# EAGLE design ScoreBoard-V2 (EAGLE 9.4.2)

## Sheet 1 of 2
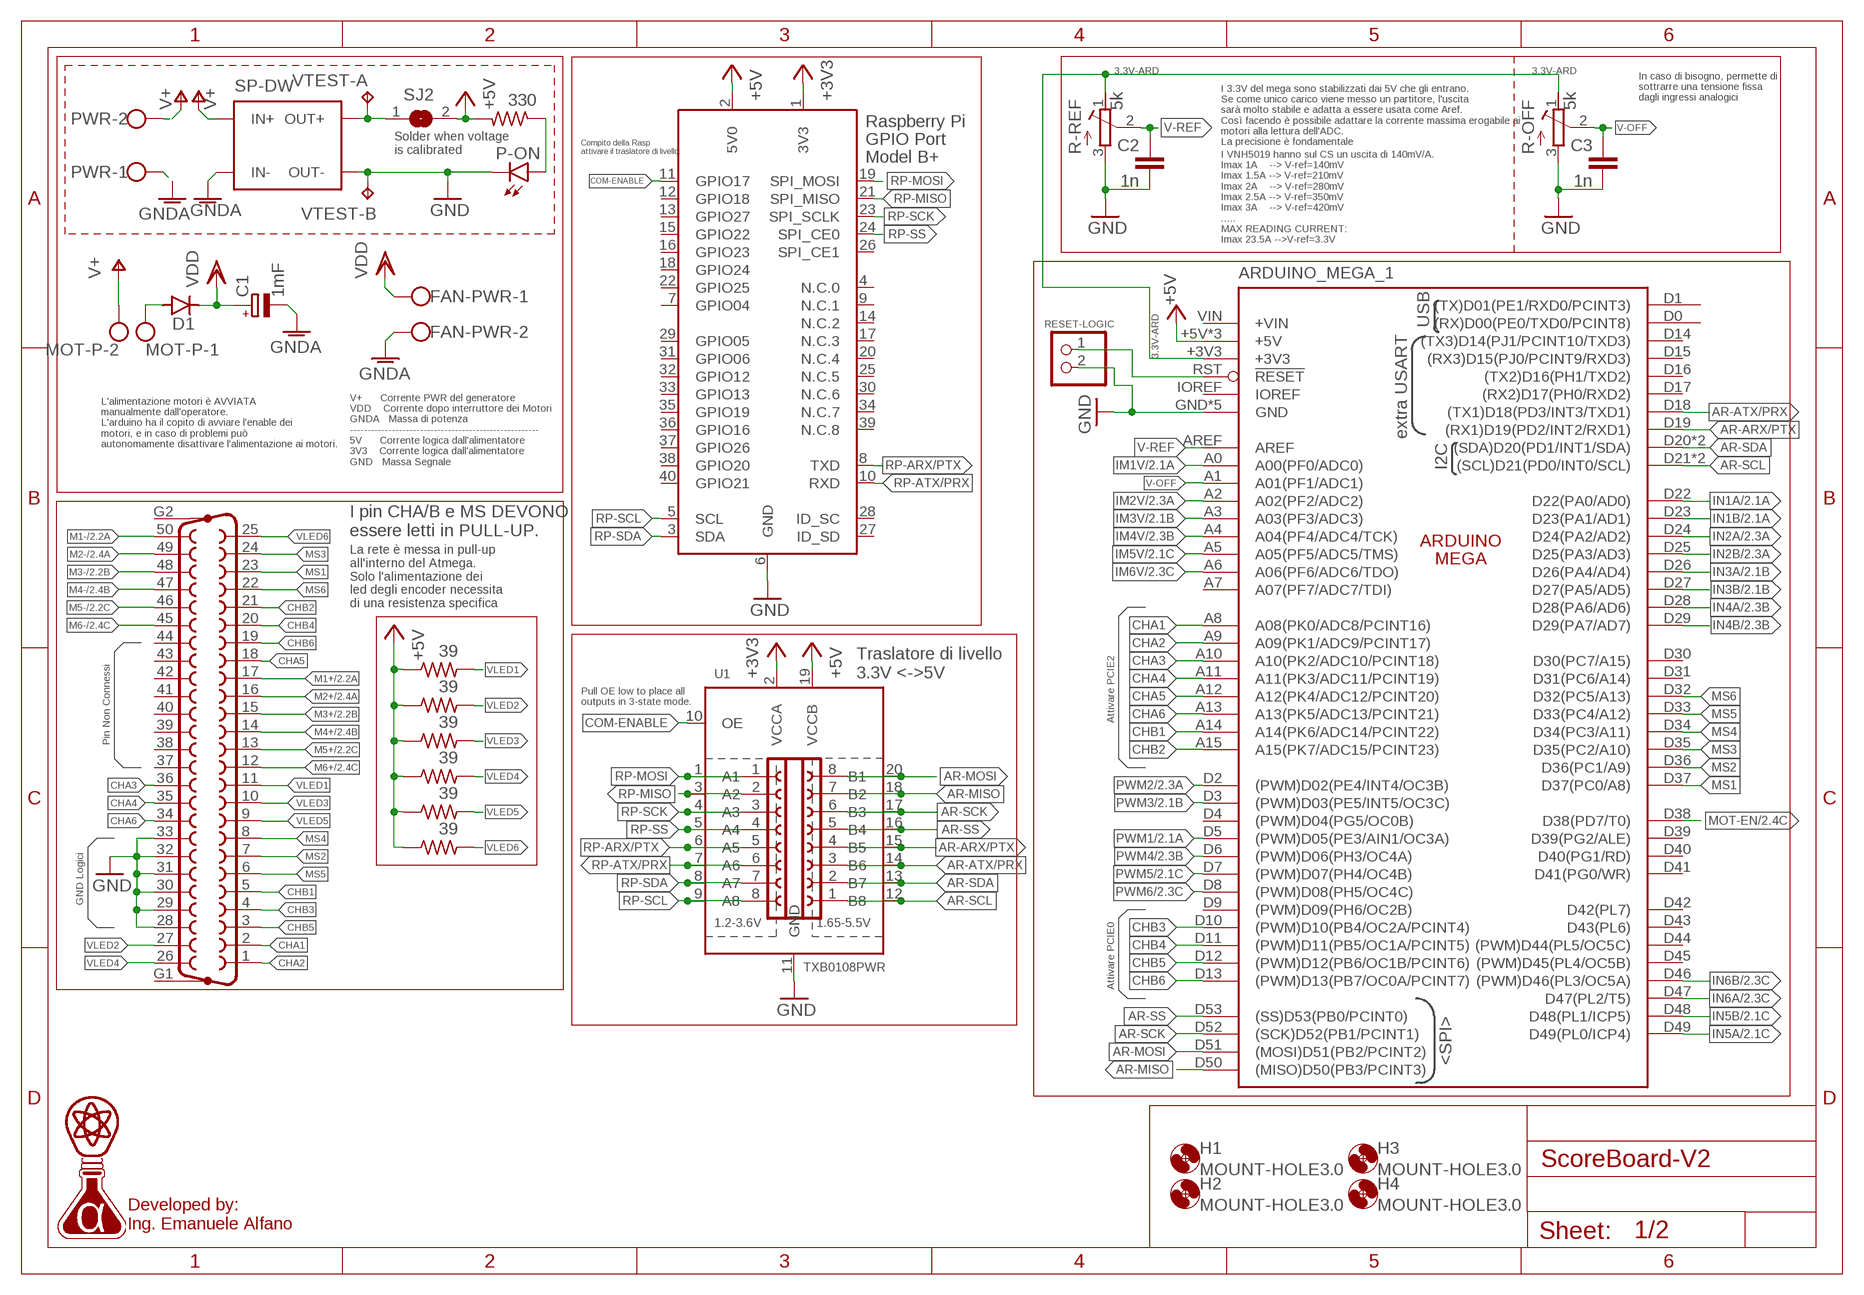
[diagram p0: schematic, sheet 1]

### Parts
ARDUINO_MEGA_1  MEGA_ARDUINONO-HOLE  [MEGA-NO-HOLE]
C1  1mF  CPOL-EUE5-13  [E5-13]
C2  1n  C-EU025-024X044  [C025-024X044]
C3  1n  C-EU025-024X044  [C025-024X044]
D1  ES2D  [SMB]
D-SUB50  F50VP  [F50VP]
FAN-PWR  W237-102  [W237-102]
H1  MOUNT-HOLE3.0  [3,0]
H2  MOUNT-HOLE3.0  [3,0]
H3  MOUNT-HOLE3.0  [3,0]
H4  MOUNT-HOLE3.0  [3,0]
MOT-P  W237-102  [W237-102]
P-ON  LED3MM  [LED3MM]
PWR  W237-102  [W237-102]
R1  39  R-US_0204/5  [0204/5]
R2  39  R-US_0204/5  [0204/5]
R3  39  R-US_0204/5  [0204/5]
R4  39  R-US_0204/5  [0204/5]
R5  39  R-US_0204/5  [0204/5]
R6  39  R-US_0204/5  [0204/5]
R-OFF  5k  R-TRIMMT93YA  [RTRIMT93YA]
R-REF  5k  R-TRIMMT93YA  [RTRIMT93YA]
RASPBERRY-PY  RASPI_GPIO_B+_BOX  [RASPI_GPIO_B+_BOX]
RESET-LOGIC  PINHD-1X2  [1X02]
RL  330  R-US_0204/7  [0204/7]
SJ2  SJ  [SJ]
SP-DW  DC/DC-STEP-DOWNGLOB  [DC/DC-STEP-DOWN-UNIVERSAL]
SV1  FE08-1  [FE08]
SV2  FE08-1  [FE08]
U1  TXB0108PWR  [TSSOP20]
VTEST-  TP2P2-38-17  [P2-38-17]

### Nets
3.3V-ARD [PLogic]: ARDUINO_MEGA_1.+3V3 R-OFF.1(E) R-REF.1(E)
+3V3: RASPBERRY-PY.1(3V3) U1.2(VCCA)
+5V [PLogic]: ARDUINO_MEGA_1.+5V ARDUINO_MEGA_1.+5V1(+5V) ARDUINO_MEGA_1.+5V2(+5V) R1.1 R2.1 R3.1 R4.1 R5.1 R6.1 RASPBERRY-PY.2(5V0) RL.2 SJ2.2 U1.19(VCCB) ; also sheet 2
AR-ARX/PTX [Logic]: ARDUINO_MEGA_1.D19((RX1)D19(PD2/INT2/RXD1)) SV2.4 U1.15(B5)
AR-ATX/PRX [Logic]: ARDUINO_MEGA_1.D18((TX1)D18(PD3/INT3/TXD1)) SV2.3 U1.14(B6)
AR-MISO [Logic]: ARDUINO_MEGA_1.D50((MISO)D50(PB3/PCINT3)) SV2.7 U1.18(B2)
AR-MOSI [Logic]: ARDUINO_MEGA_1.D51((MOSI)D51(PB2/PCINT2)) SV2.8 U1.20(B1)
AR-SCK [Logic]: ARDUINO_MEGA_1.D52((SCK)D52(PB1/PCINT1)) SV2.6 U1.17(B3)
AR-SCL [Logic]: ARDUINO_MEGA_1.D21((SCL)D21(PD0/INT0/SCL)) ARDUINO_MEGA_1.SCL1((SCL)D21(PD0/INT0/SCL)) SV2.1 U1.12(B8)
AR-SDA [Logic]: ARDUINO_MEGA_1.D20((SDA)D20(PD1/INT1/SDA)) ARDUINO_MEGA_1.SDA1((SDA)D20(PD1/INT1/SDA)) SV2.2 U1.13(B7)
AR-SS [Logic]: ARDUINO_MEGA_1.D53((SS)D53(PB0/PCINT0)) SV2.5 U1.16(B4)
CHA1 [Logic]: ARDUINO_MEGA_1.A8(A08(PK0/ADC8/PCINT16)) D-SUB50.2
CHA2 [Logic]: ARDUINO_MEGA_1.A9(A09(PK1/ADC9/PCINT17)) D-SUB50.1
CHA3 [Logic]: ARDUINO_MEGA_1.A10(A10(PK2/ADC10/PCINT18)) D-SUB50.36
CHA4 [Logic]: ARDUINO_MEGA_1.A11(A11(PK3/ADC11/PCINT19)) D-SUB50.35
CHA5 [Logic]: ARDUINO_MEGA_1.A12(A12(PK4/ADC12/PCINT20)) D-SUB50.18
CHA6 [Logic]: ARDUINO_MEGA_1.A13(A13(PK5/ADC13/PCINT21)) D-SUB50.34
CHB1 [Logic]: ARDUINO_MEGA_1.A14(A14(PK6/ADC14/PCINT22)) D-SUB50.5
CHB2 [Logic]: ARDUINO_MEGA_1.A15(A15(PK7/ADC15/PCINT23)) D-SUB50.21
CHB3 [Logic]: ARDUINO_MEGA_1.D10((PWM)D10(PB4/OC2A/PCINT4)) D-SUB50.4
CHB4 [Logic]: ARDUINO_MEGA_1.D11((PWM)D11(PB5/OC1A/PCINT5)) D-SUB50.20
CHB5 [Logic]: ARDUINO_MEGA_1.D12((PWM)D12(PB6/OC1B/PCINT6)) D-SUB50.3
CHB6 [Logic]: ARDUINO_MEGA_1.D13((PWM)D13(PB7/OC0A/PCINT7)) D-SUB50.19
COM-ENABLE: RASPBERRY-PY.11(GPIO17) U1.10(OE)
GND [PLogic]: ARDUINO_MEGA_1.GND ARDUINO_MEGA_1.GND1(GND) ARDUINO_MEGA_1.GND2(GND) ARDUINO_MEGA_1.GND3(GND) ARDUINO_MEGA_1.GND4(GND) C2.2 C3.2 D-SUB50.28 D-SUB50.29 D-SUB50.30 D-SUB50.31 D-SUB50.32 D-SUB50.33 P-ON.K(C) R-OFF.3(A) R-REF.3(A) RASPBERRY-PY.6(GND) RESET-LOGIC.2 SP-DW.OUT- SP-DW.OUT-1(OUT-) SP-DW.OUT-2(OUT-) U1.11(GND) VTEST-.TP-2 ; also sheet 2
GNDA [PowerJack]: C1.- FAN-PWR.2 PWR.1 SP-DW.IN- SP-DW.IN-1(IN-) SP-DW.IN-2(IN-) ; also sheet 2
IM1V [Logic]: ARDUINO_MEGA_1.A0(A00(PF0/ADC0)) ; also sheet 2
IM2V [Logic]: ARDUINO_MEGA_1.A2(A02(PF2/ADC2)) ; also sheet 2
IM3V [Logic]: ARDUINO_MEGA_1.A3(A03(PF3/ADC3)) ; also sheet 2
IM4V [Logic]: ARDUINO_MEGA_1.A4(A04(PF4/ADC4/TCK)) ; also sheet 2
IM5V [Logic]: ARDUINO_MEGA_1.A5(A05(PF5/ADC5/TMS)) ; also sheet 2
IM6V [Logic]: ARDUINO_MEGA_1.A6(A06(PF6/ADC6/TDO)) ; also sheet 2
IN1A [Logic]: ARDUINO_MEGA_1.D22(D22(PA0/AD0)) ; also sheet 2
IN1B [Logic]: ARDUINO_MEGA_1.D23(D23(PA1/AD1)) ; also sheet 2
IN2A [Logic]: ARDUINO_MEGA_1.D24(D24(PA2/AD2)) ; also sheet 2
IN2B [Logic]: ARDUINO_MEGA_1.D25(D25(PA3/AD3)) ; also sheet 2
IN3A [Logic]: ARDUINO_MEGA_1.D26(D26(PA4/AD4)) ; also sheet 2
IN3B [Logic]: ARDUINO_MEGA_1.D27(D27(PA5/AD5)) ; also sheet 2
IN4A [Logic]: ARDUINO_MEGA_1.D28(D28(PA6/AD6)) ; also sheet 2
IN4B [Logic]: ARDUINO_MEGA_1.D29(D29(PA7/AD7)) ; also sheet 2
IN5A [Logic]: ARDUINO_MEGA_1.D49(D49(PL0/ICP4)) ; also sheet 2
IN5B [Logic]: ARDUINO_MEGA_1.D48(D48(PL1/ICP5)) ; also sheet 2
IN6A [Logic]: ARDUINO_MEGA_1.D47(D47(PL2/T5)) ; also sheet 2
IN6B [Logic]: ARDUINO_MEGA_1.D46((PWM)D46(PL3/OC5A)) ; also sheet 2
M1+ [PMot]: D-SUB50.17 ; also sheet 2
M1- [PMot]: D-SUB50.50 ; also sheet 2
M2+ [PMot]: D-SUB50.16 ; also sheet 2
M2- [PMot]: D-SUB50.49 ; also sheet 2
M3+ [PMot]: D-SUB50.15 ; also sheet 2
M3- [PMot]: D-SUB50.48 ; also sheet 2
M4+ [PMot]: D-SUB50.14 ; also sheet 2
M4- [PMot]: D-SUB50.47 ; also sheet 2
M5+ [PMot]: D-SUB50.13 ; also sheet 2
M5- [PMot]: D-SUB50.46 ; also sheet 2
M6+ [PMot]: D-SUB50.12 ; also sheet 2
M6- [PMot]: D-SUB50.45 ; also sheet 2
MOT-EN [Logic]: ARDUINO_MEGA_1.D38(D38(PD7/T0)) ; also sheet 2
MS1 [Logic]: ARDUINO_MEGA_1.D37(D37(PC0/A8)) D-SUB50.23
MS2 [Logic]: ARDUINO_MEGA_1.D36(D36(PC1/A9)) D-SUB50.7
MS3 [Logic]: ARDUINO_MEGA_1.D35(D35(PC2/A10)) D-SUB50.24
MS4 [Logic]: ARDUINO_MEGA_1.D34(D34(PC3/A11)) D-SUB50.8
MS5 [Logic]: ARDUINO_MEGA_1.D33(D33(PC4/A12)) D-SUB50.6
MS6 [Logic]: ARDUINO_MEGA_1.D32(D32(PC5/A13)) D-SUB50.22
N$1: P-ON.A RL.1
N$2 [PowerJack]: D1.A MOT-P.1
N$4 [PLogic]: SJ2.1 SP-DW.OUT+ SP-DW.OUT+1(OUT+) SP-DW.OUT+2(OUT+) VTEST-.TP-1
N$5: ARDUINO_MEGA_1.RST(!RESET) RESET-LOGIC.1
PWM1 [Logic]: ARDUINO_MEGA_1.D5((PWM)D05(PE3/AIN1/OC3A)) ; also sheet 2
PWM2 [Logic]: ARDUINO_MEGA_1.D2((PWM)D02(PE4/INT4/OC3B)) ; also sheet 2
PWM3 [Logic]: ARDUINO_MEGA_1.D3((PWM)D03(PE5/INT5/OC3C)) ; also sheet 2
PWM4 [Logic]: ARDUINO_MEGA_1.D6((PWM)D06(PH3/OC4A)) ; also sheet 2
PWM5 [Logic]: ARDUINO_MEGA_1.D7((PWM)D07(PH4/OC4B)) ; also sheet 2
PWM6 [Logic]: ARDUINO_MEGA_1.D8((PWM)D08(PH5/OC4C)) ; also sheet 2
RP-ARX/PTX: RASPBERRY-PY.8(TXD) SV1.5 U1.6(A5)
RP-ATX/PRX: RASPBERRY-PY.10(RXD) SV1.6 U1.7(A6)
RP-MISO: RASPBERRY-PY.21(SPI_MISO) SV1.2 U1.3(A2)
RP-MOSI: RASPBERRY-PY.19(SPI_MOSI) SV1.1 U1.1(A1)
RP-SCK: RASPBERRY-PY.23(SPI_SCLK) SV1.3 U1.4(A3)
RP-SCL: RASPBERRY-PY.5(SCL) SV1.8 U1.9(A8)
RP-SDA: RASPBERRY-PY.3(SDA) SV1.7 U1.8(A7)
RP-SS: RASPBERRY-PY.24(SPI_CE0) SV1.4 U1.5(A4)
V+ [PowerJack]: MOT-P.2 PWR.2 SP-DW.IN+ SP-DW.IN+1(IN+) SP-DW.IN+2(IN+)
V-OFF [Logic]: ARDUINO_MEGA_1.A1(A01(PF1/ADC1)) C3.1 R-OFF.2(S)
V-REF [Logic]: ARDUINO_MEGA_1.AREF C2.1 R-REF.2(S)
VDD [PowerJack]: C1.+ D1.C FAN-PWR.1 ; also sheet 2
VLED1 [PLogic]: D-SUB50.11 R1.2
VLED2 [PLogic]: D-SUB50.27 R2.2
VLED3 [PLogic]: D-SUB50.10 R3.2
VLED4 [PLogic]: D-SUB50.26 R4.2
VLED5 [PLogic]: D-SUB50.9 R5.2
VLED6 [PLogic]: D-SUB50.25 R6.2
Unconnected: ARDUINO_MEGA_1.A7(A07(PF7/ADC7/TDI)) ARDUINO_MEGA_1.D0((RX)D00(PE0/TXD0/PCINT8)) ARDUINO_MEGA_1.D1((TX)D01(PE1/RXD0/PCINT3)) ARDUINO_MEGA_1.D4((PWM)D04(PG5/OC0B)) ARDUINO_MEGA_1.D9((PWM)D09(PH6/OC2B)) ARDUINO_MEGA_1.D14((TX3)D14(PJ1/PCINT10/TXD3)) ARDUINO_MEGA_1.D15((RX3)D15(PJ0/PCINT9/RXD3)) ARDUINO_MEGA_1.D16((TX2)D16(PH1/TXD2)) ARDUINO_MEGA_1.D17((RX2)D17(PH0/RXD2)) ARDUINO_MEGA_1.D30(D30(PC7/A15)) ARDUINO_MEGA_1.D31(D31(PC6/A14)) ARDUINO_MEGA_1.D39(D39(PG2/ALE)) ARDUINO_MEGA_1.D40(D40(PG1/RD)) ARDUINO_MEGA_1.D41(D41(PG0/WR)) ARDUINO_MEGA_1.D42(D42(PL7)) ARDUINO_MEGA_1.D43(D43(PL6)) ARDUINO_MEGA_1.D44((PWM)D44(PL5/OC5C)) ARDUINO_MEGA_1.D45((PWM)D45(PL4/OC5B)) ARDUINO_MEGA_1.IOREF ARDUINO_MEGA_1.VIN(+VIN) D-SUB50.37 D-SUB50.38 D-SUB50.39 D-SUB50.40 D-SUB50.41 D-SUB50.42 D-SUB50.43 D-SUB50.44 D-SUB50.G1 D-SUB50.G2 RASPBERRY-PY.4(N.C.0) RASPBERRY-PY.7(GPIO04) RASPBERRY-PY.9(N.C.1) RASPBERRY-PY.12(GPIO18) RASPBERRY-PY.13(GPIO27) RASPBERRY-PY.14(N.C.2) RASPBERRY-PY.15(GPIO22) RASPBERRY-PY.16(GPIO23) RASPBERRY-PY.17(N.C.3) RASPBERRY-PY.18(GPIO24) RASPBERRY-PY.20(N.C.4) RASPBERRY-PY.22(GPIO25) RASPBERRY-PY.25(N.C.5) RASPBERRY-PY.26(SPI_CE1) RASPBERRY-PY.27(ID_SD) RASPBERRY-PY.28(ID_SC) RASPBERRY-PY.29(GPIO05) RASPBERRY-PY.30(N.C.6) RASPBERRY-PY.31(GPIO06) RASPBERRY-PY.32(GPIO12) RASPBERRY-PY.33(GPIO13) RASPBERRY-PY.34(N.C.7) RASPBERRY-PY.35(GPIO19) RASPBERRY-PY.36(GPIO16) RASPBERRY-PY.37(GPIO26) RASPBERRY-PY.38(GPIO20) RASPBERRY-PY.39(N.C.8) RASPBERRY-PY.40(GPIO21)

### Notes on the sheet
- In caso di bisogno, permette di
  sottrarre una tensione fissa
  dagli ingressi analogici
- I 3.3V del mega sono stabilizzati dai 5V che gli entrano.
  Se come unico carico viene messo un partitore, l'uscita 
  sarà molto stabile e adatta a essere usata come Aref.
  Così facendo è possibile adattare la corrente massima erogabile ai
  motori alla lettura dell'ADC.
  La precisione è fondamentale
- Solder when voltage
  is calibrated
- Compito della Rasp 
  attivare il traslatore di livello
- I VNH5019 hanno sul CS un uscita di 140mV/A.
  Imax 1A    --> V-ref=140mV
  Imax 1.5A --> V-ref=210mV
  Imax 2A    --> V-ref=280mV
  Imax 2.5A --> V-ref=350mV
  Imax 3A    --> V-ref=420mV
  .....
  MAX READING CURRENT:
  Imax 23.5A -->V-ref=3.3V
- L'alimentazione motori è AVVIATA
  manualmente dall'operatore.
  L'arduino ha il copito di avviare l'enable dei
  motori, e in caso di problemi può
  autonomamente disattivare l'alimentazione ai motori.
- V+      Corrente PWR del generatore
  VDD    Corrente dopo interruttore dei Motori
  GNDA   Massa di potenza
  ------------------------------------------------------
  5V      Corrente logica dall'alimentatore
  3V3    Corrente logica dall'alimentatore
  GND   Massa Segnale
- I pin CHA/B e MS DEVONO
  essere letti in PULL-UP.
- La rete è messa in pull-up
  all'interno del Atmega.
  Solo l'alimentazione dei
  led degli encoder necessita
  di una resistenza specifica
- Traslatore di livello
  3.3V <->5V
- Pull OE low to place all
  outputs in 3-state mode.
- Attivare PCIE2
- Pin Non Connessi
- GND Logici
- Attivare PCIE0
- Developed by:
  Ing. Emanuele Alfano

## Sheet 2 of 2
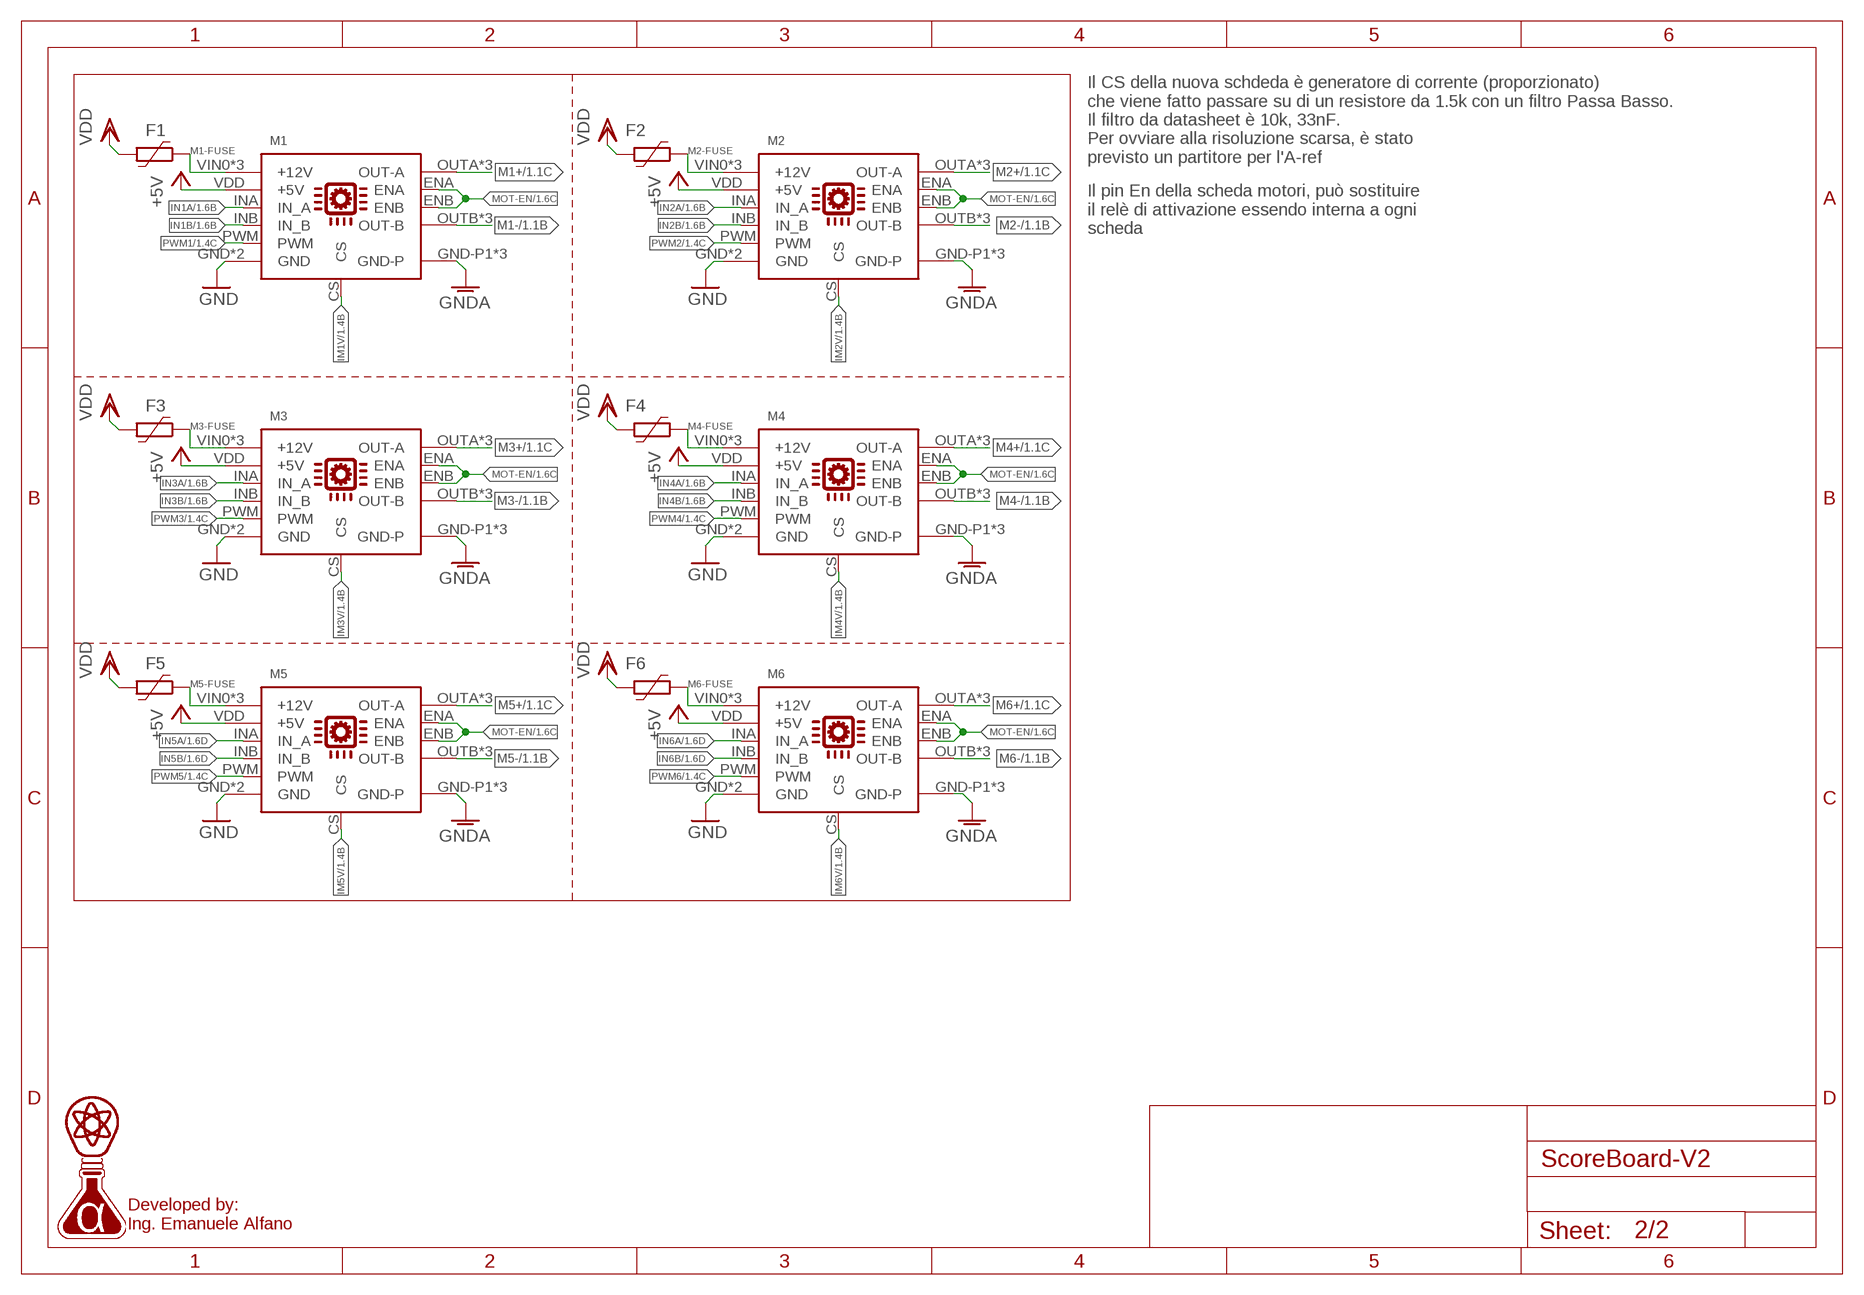
[diagram p1: schematic, sheet 2]

### Parts
F1  2410-BOX  [BELFUSE0679-3000-12]
F2  2410-BOX  [BELFUSE0679-3000-12]
F3  2410-BOX  [BELFUSE0679-3000-12]
F4  2410-BOX  [BELFUSE0679-3000-12]
F5  2410-BOX  [BELFUSE0679-3000-12]
F6  2410-BOX  [BELFUSE0679-3000-12]
M1  VNH5019  [VNH5019]
M2  VNH5019  [VNH5019]
M3  VNH5019  [VNH5019]
M4  VNH5019  [VNH5019]
M5  VNH5019  [VNH5019]
M6  VNH5019  [VNH5019]

### Nets
+5V [PLogic]: M1.VDD(+5V) M2.VDD(+5V) M3.VDD(+5V) M4.VDD(+5V) M5.VDD(+5V) M6.VDD(+5V) ; also sheet 1
GND [PLogic]: M1.GND M1.GND1(GND) M2.GND M2.GND1(GND) M3.GND M3.GND1(GND) M4.GND M4.GND1(GND) M5.GND M5.GND1(GND) M6.GND M6.GND1(GND) ; also sheet 1
GNDA [PowerJack]: M1.GND-P1(GND-P) M1.GND-P2(GND-P) M1.GND-P3(GND-P) M2.GND-P1(GND-P) M2.GND-P2(GND-P) M2.GND-P3(GND-P) M3.GND-P1(GND-P) M3.GND-P2(GND-P) M3.GND-P3(GND-P) M4.GND-P1(GND-P) M4.GND-P2(GND-P) M4.GND-P3(GND-P) M5.GND-P1(GND-P) M5.GND-P2(GND-P) M5.GND-P3(GND-P) M6.GND-P1(GND-P) M6.GND-P2(GND-P) M6.GND-P3(GND-P) ; also sheet 1
IM1V [Logic]: M1.CS ; also sheet 1
IM2V [Logic]: M2.CS ; also sheet 1
IM3V [Logic]: M3.CS ; also sheet 1
IM4V [Logic]: M4.CS ; also sheet 1
IM5V [Logic]: M5.CS ; also sheet 1
IM6V [Logic]: M6.CS ; also sheet 1
IN1A [Logic]: M1.INA(IN_A) ; also sheet 1
IN1B [Logic]: M1.INB(IN_B) ; also sheet 1
IN2A [Logic]: M2.INA(IN_A) ; also sheet 1
IN2B [Logic]: M2.INB(IN_B) ; also sheet 1
IN3A [Logic]: M3.INA(IN_A) ; also sheet 1
IN3B [Logic]: M3.INB(IN_B) ; also sheet 1
IN4A [Logic]: M4.INA(IN_A) ; also sheet 1
IN4B [Logic]: M4.INB(IN_B) ; also sheet 1
IN5A [Logic]: M5.INA(IN_A) ; also sheet 1
IN5B [Logic]: M5.INB(IN_B) ; also sheet 1
IN6A [Logic]: M6.INA(IN_A) ; also sheet 1
IN6B [Logic]: M6.INB(IN_B) ; also sheet 1
M1+ [PMot]: M1.OUTA2(OUT-A) M1.OUTA3(OUT-A) M1.OUTA(OUT-A) ; also sheet 1
M1- [PMot]: M1.OUTB1(OUT-B) M1.OUTB3(OUT-B) M1.OUTB(OUT-B) ; also sheet 1
M1-FUSE [PowerJack]: F1.1 M1.VIN0(+12V) M1.VIN1(+12V) M1.VIN2(+12V)
M2+ [PMot]: M2.OUTA2(OUT-A) M2.OUTA3(OUT-A) M2.OUTA(OUT-A) ; also sheet 1
M2- [PMot]: M2.OUTB1(OUT-B) M2.OUTB3(OUT-B) M2.OUTB(OUT-B) ; also sheet 1
M2-FUSE [PowerJack]: F2.1 M2.VIN0(+12V) M2.VIN1(+12V) M2.VIN2(+12V)
M3+ [PMot]: M3.OUTA2(OUT-A) M3.OUTA3(OUT-A) M3.OUTA(OUT-A) ; also sheet 1
M3- [PMot]: M3.OUTB1(OUT-B) M3.OUTB3(OUT-B) M3.OUTB(OUT-B) ; also sheet 1
M3-FUSE [PowerJack]: F3.1 M3.VIN0(+12V) M3.VIN1(+12V) M3.VIN2(+12V)
M4+ [PMot]: M4.OUTA2(OUT-A) M4.OUTA3(OUT-A) M4.OUTA(OUT-A) ; also sheet 1
M4- [PMot]: M4.OUTB1(OUT-B) M4.OUTB3(OUT-B) M4.OUTB(OUT-B) ; also sheet 1
M4-FUSE [PowerJack]: F4.1 M4.VIN0(+12V) M4.VIN1(+12V) M4.VIN2(+12V)
M5+ [PMot]: M5.OUTA2(OUT-A) M5.OUTA3(OUT-A) M5.OUTA(OUT-A) ; also sheet 1
M5- [PMot]: M5.OUTB1(OUT-B) M5.OUTB3(OUT-B) M5.OUTB(OUT-B) ; also sheet 1
M5-FUSE [PowerJack]: F5.1 M5.VIN0(+12V) M5.VIN1(+12V) M5.VIN2(+12V)
M6+ [PMot]: M6.OUTA2(OUT-A) M6.OUTA3(OUT-A) M6.OUTA(OUT-A) ; also sheet 1
M6- [PMot]: M6.OUTB1(OUT-B) M6.OUTB3(OUT-B) M6.OUTB(OUT-B) ; also sheet 1
M6-FUSE [PowerJack]: F6.1 M6.VIN0(+12V) M6.VIN1(+12V) M6.VIN2(+12V)
MOT-EN [Logic]: M1.ENA M1.ENB M2.ENA M2.ENB M3.ENA M3.ENB M4.ENA M4.ENB M5.ENA M5.ENB M6.ENA M6.ENB ; also sheet 1
PWM1 [Logic]: M1.PWM ; also sheet 1
PWM2 [Logic]: M2.PWM ; also sheet 1
PWM3 [Logic]: M3.PWM ; also sheet 1
PWM4 [Logic]: M4.PWM ; also sheet 1
PWM5 [Logic]: M5.PWM ; also sheet 1
PWM6 [Logic]: M6.PWM ; also sheet 1
VDD [PowerJack]: F1.2 F2.2 F3.2 F4.2 F5.2 F6.2 ; also sheet 1

### Notes on the sheet
- Il CS della nuova schdeda è generatore di corrente (proporzionato)
  che viene fatto passare su di un resistore da 1.5k con un filtro Passa Basso.
  Il filtro da datasheet è 10k, 33nF.
  Per ovviare alla risoluzione scarsa, è stato
  previsto un partitore per l'A-ref
- Il pin En della scheda motori, può sostituire
  il relè di attivazione essendo interna a ogni
  scheda
- Developed by:
  Ing. Emanuele Alfano

## Library data of the parts
ARDUINO_MEGA_1 = ARDUINO_DODO:MEGA_ARDUINO
C1 = rcl:CPOL-EU: POLARIZED CAPACITOR, European symbol; SPICEPREFIX: C
C2 C3 = rcl:C-EU: CAPACITOR, European symbol; SPICEPREFIX: C
D1 = diode:ES2D: DIODE super fast rectifier, 2 A
D-SUB50 = con-subd:F50VP: SUB-D; OC_FARNELL: unknown; OC_NEWARK: unknown
F1-F6 = polyfuse-smd_10:?: Polyfuse Resettable PTC Source: http://www.littelfuse.com/products/resettable-ptcs.aspx
FAN-PWR MOT-P PWR = con-wago-500:W237-102: WAGO SCREW CLAMP; MPN: 237-102; OC_FARNELL: unknown; OC_NEWARK: 70K9898
H1-H4 = holes:MOUNT-HOLE: MOUNTING HOLE with drill center marker
M1-M6 = DRIVER POLOLU:VNH5019: aggiornato il 24/10/14 con pin cs (AD)
P-ON = led:LED: LED OSRAM: - CHIPLED LG R971, LG N971, LY N971, LG Q971, LY Q971, LO R971, LY R971 LH N974, LH R974 LS Q976, LO Q976, LY Q976 LO Q996 - Hyper CHIPLED LW Q18S LB Q993, LB Q99A, LB R99A - SideLED LS A670, LO A670, LY A670, LG A670, LP A670 LB A673, LV A673, LT A673, LW A673 LH A674 LY A675 LS A676, LA A676, LO A676, LY A676, LW A676 LS A679, LY A679, LG A679 - Hyper Micro SIDELED® LS Y876, LA Y876, LO Y876, LY Y876 LT Y87S - SmartLED LW L88C, LW L88S LB L89C, LB L89S, LG L890 LS L89K, LO L89K, LY L89K LS L896, LA L896, LO L896, LY L896 - TOPLED LS T670, LO T670, LY T670, LG T670, LP T670 LSG T670, LSP T670, LSY T670, LOP T670, LYG T670 LG T671, LOG T671, LSG T671 LB T673, LV T673, LT T673, LW T673 LH T674 LS T676, LA T676, LO T676, LY T676, LB T676, LH T676, LSB T676, LW T676 LB T67C, LV T67C, LT T67C, LS T67K, LO T67K, LY T67K, LW E67C LS E67B, LA E67B, LO E67B, LY E67B, LB E67C, LV E67C, LT E67C LW T67C LS T679, LY T679, LG T679 LS T770, LO T770, LY T770, LG T770, LP T770 LB T773, LV T773, LT T773, LW T773 LH T774 LS E675, LA E675, LY E675, LS T675 LS T776, LA T776, LO T776, LY T776, LB T776 LHGB T686 LT T68C, LB T68C - Hyper Mini TOPLED® LB M676 - Mini TOPLED Santana® LG M470 LS M47K, LO M47K, LY M47K Source: http://www.osram.convergy.de LUXEON: - LUMILED® LXK2-PW12-R00, LXK2-PW12-S00, LXK2-PW14-U00, LXK2-PW14-V00 LXK2-PM12-R00, LXK2-PM12-S00, LXK2-PM14-U00 LXK2-PE12-Q00, LXK2-PE12-R00, LXK2-PE12-S00, LXK2-PE14-T00, LXK2-PE14-U00 LXK2-PB12-K00, LXK2-PB12-L00, LXK2-PB12-M00, LXK2-PB14-N00, LXK2-PB14-P00, LXK2-PB14-Q00 LXK2-PR12-L00, LXK2-PR12-M00, LXK2-PR14-Q00, LXK2-PR14-R00 LXK2-PD12-Q00, LXK2-PD12-R00, LXK2-PD12-S00 LXK2-PH12-R00, LXK2-PH12-S00 LXK2-PL12-P00, LXK2-PL12-Q00, LXK2-PL12-R00 Source: www.luxeon.com KINGBRIGHT: KA-3528ASYC Source: www.kingbright.com
R1-R6 RL = rcl:R-US_: RESISTOR, American symbol; SPICEPREFIX: R
R-OFF R-REF = rcl:R-TRIMM: Trimm resistor; SPICEMODEL: X; SPICEPREFIXL: POT
RASPBERRY-PY = raspberrypi_bastelstube_v13:RASPI_GPIO_B+: Only the 2x20 header connector, nothing else
RESET-LOGIC = pinhead:PINHD-1X2: PIN HEADER
SJ2 = jumper:SJ: SMD solder JUMPER; SPICEPREFIX: B
SP-DW = diy-modules:DC/DC-STEP-DOWN: Step-down DC/DC basato su mp1584
SV1 SV2 = con-lsta:FE08-1: FEMALE HEADER; OC_FARNELL: unknown; OC_NEWARK: unknown
U1 = TXB0108PWR:TXB0108PWR: 8-Bit Bi-Directional Level Shifter 1.2V-3.6V (VCCA) to 1.65V-5.5V (VCCB) bi-directional level shifter with auto direction sensing. Max data rate - VCCA 1.8V: 20Mbps (50ns), VCCA 3.3V: 100Mbps (10ns) Digikey: 296-21527-1-ND; AVAILABILITY: Unavailable; DESCRIPTION: 8-Bit Bidirectional Voltage-Level Translator with Auto Direction Sensing and +/-15-kV ESD Protect 20-TSSOP -40 to 85; MF: Texas Instruments; MP: TXB0108PWR; PACKAGE: TSSOP-20 Texas Instruments; PRICE: None
VTEST- = testpad:TP2: Test pad; SPICEPREFIX: X

## Net classes
1 PowerJack: width 1.778 mm, drill 0.813 mm, clearance 0.254 mm
2 PMot: width 0.635 mm, drill 0.406 mm, clearance 0.203 mm
3 PLogic: width 0.203 mm, drill 0.406 mm, clearance 0.152 mm
4 Logic: width 0.152 mm

## Board
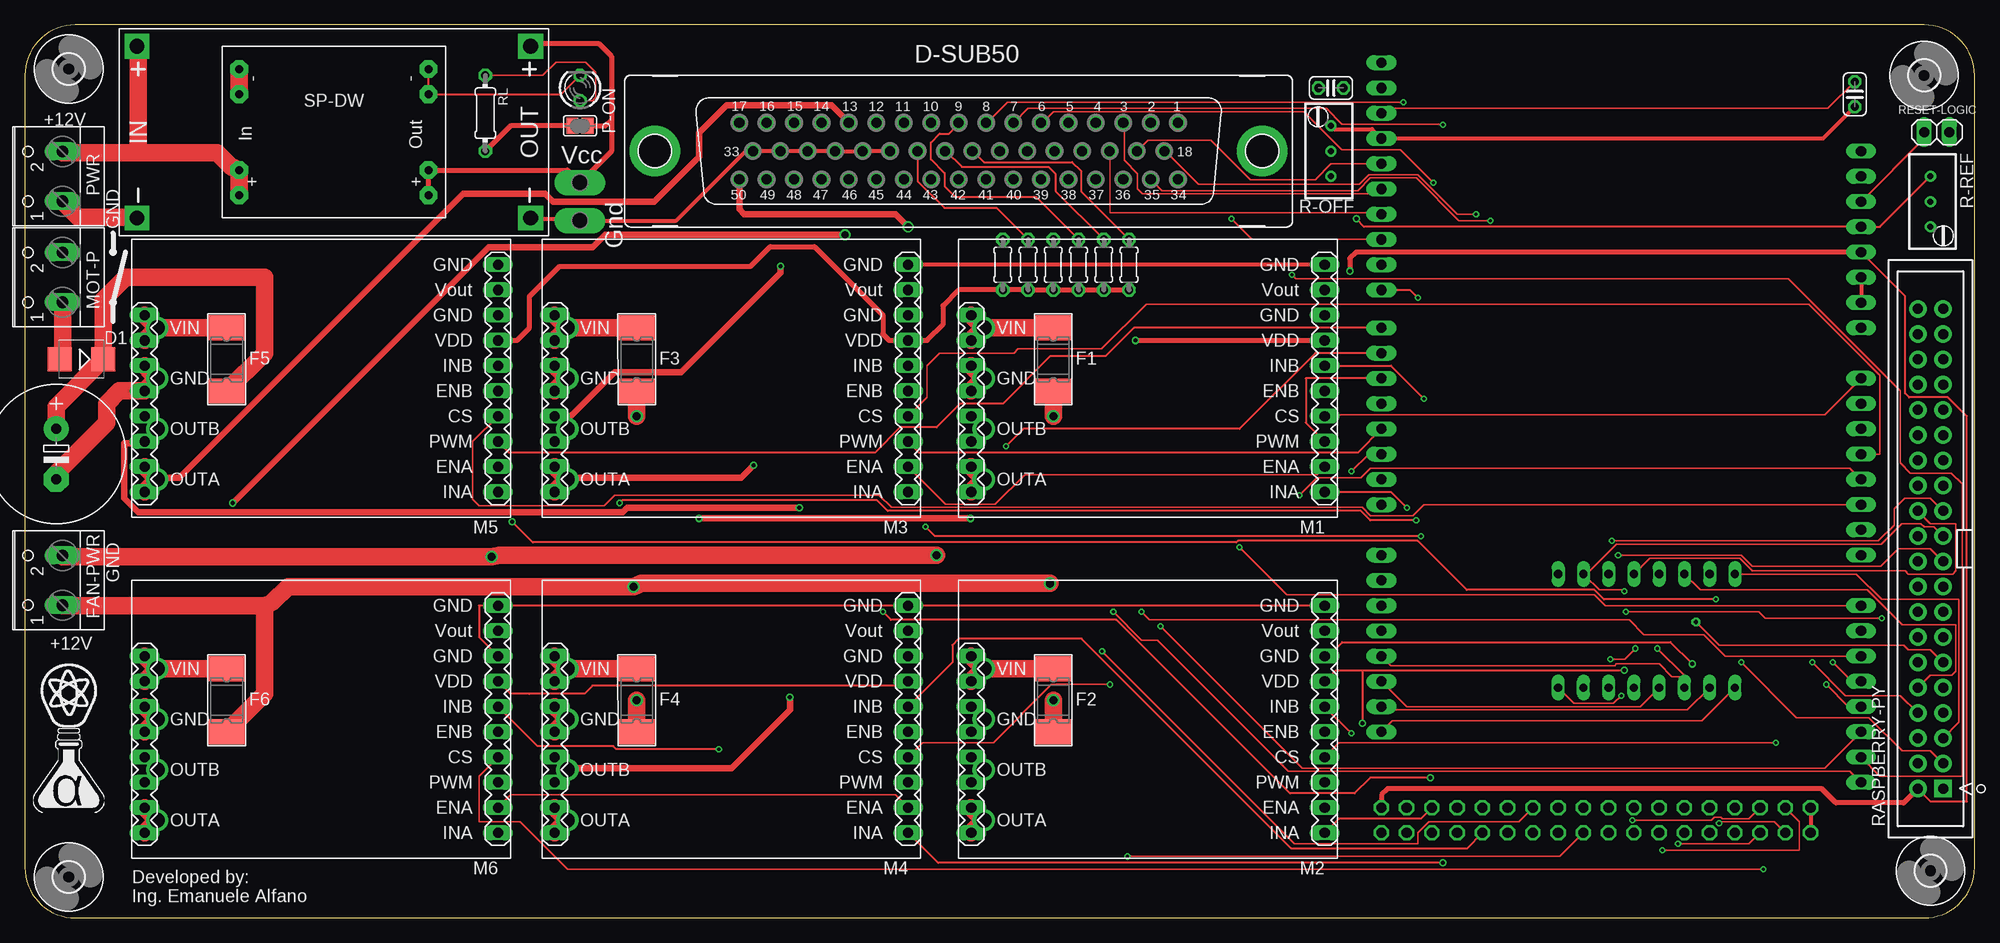
[diagram p2: board, top side]
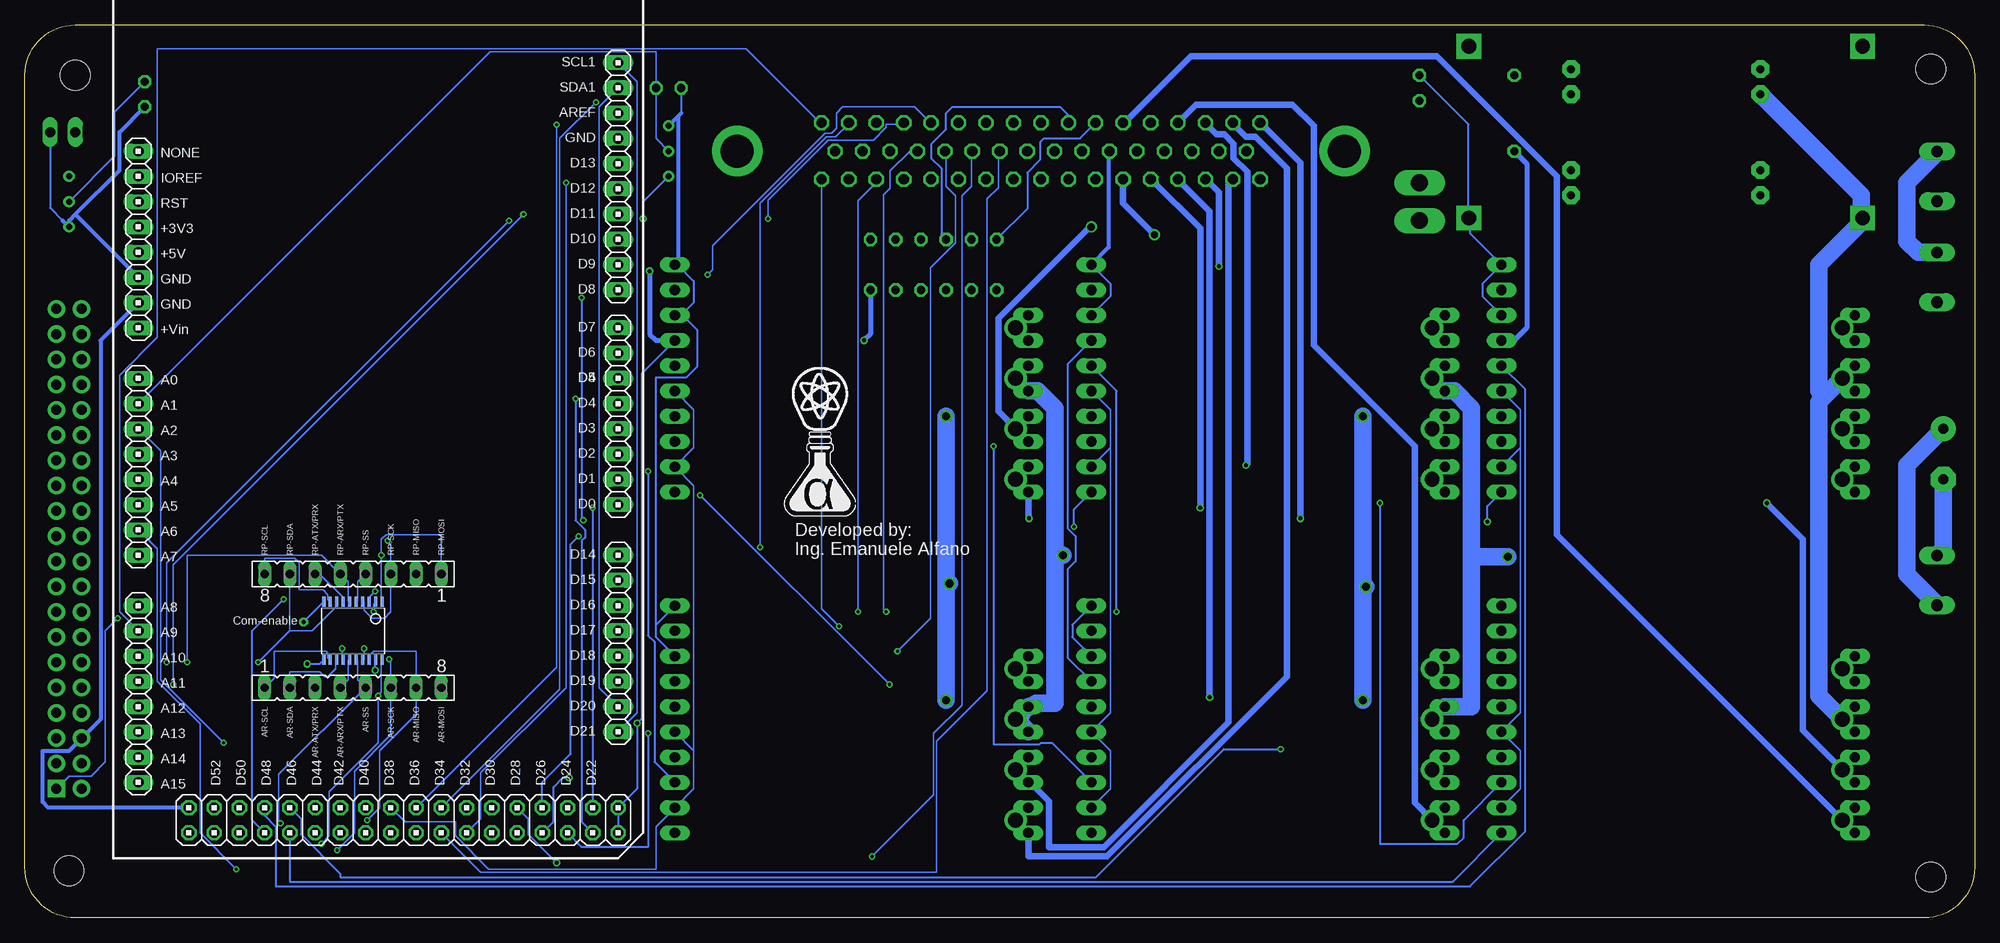
[diagram p3: board, bottom side, seen from below]

Size 196.19 x 89.84 mm. Coordinates in mm from the lower left corner, seen from the top.
Outline: 5.08,0 191.11,0 arc90 196.19,5.08 196.19,84.76 arc90 191.11,89.84 5.08,89.84 arc90 0,84.76 0,5.08 arc90 5.08,0
Copper layers (1*16): Top 0.035mm / dielectric 1.5mm / Bottom 0.035mm
Design rules "SeeedStudio_2layer_DRU_no_angle_20140221": minimum track width 6mil, minimum drill 12mil, track to track 6mil, track to pad 6mil, pad to pad 6mil, via to via 6mil, smd to smd 0mil, copper to edge 10mil, drill to drill 10mil, minimum pad ring 10mil, minimum via ring 6mil, stop-mask expansion 2mil, vias tented up to drill 100mil, thermal gap 10mil

### Footprints (pad centres in the part's own frame; a part is rotated, then mirrored left to right if it is on the bottom)
MEGA-NO-HOLE = drill 1.016 long: +3V3 35.56,2.54; +5V2 38.1,2.54; A0 50.8,2.54; A1 53.34,2.54; A2 55.88,2.54; A3 58.42,2.54; A4 60.96,2.54; A5 63.5,2.54; A6 66.04,2.54; A7 68.58,2.54; A8 73.66,2.54; A9 76.2,2.54; A10 78.74,2.54; A11 81.28,2.54; A12 83.82,2.54; A13 86.36,2.54; A14 88.9,2.54; A15 91.44,2.54; AREF 24.13,50.8; D0 63.5,50.8; D1 60.96,50.8; D2 58.42,50.8; D3 55.88,50.8; D4 53.34,50.8; D5 50.8,50.8; D6 48.26,50.8; D7 45.72,50.8; D8 41.91,50.8; D9 39.37,50.8; D10 36.83,50.8; D11 34.29,50.8; D12 31.75,50.8; D13 29.21,50.8; D14 68.58,50.8; D15 71.12,50.8; D16 73.66,50.8; D17 76.2,50.8; D18 78.74,50.8; D19 81.28,50.8; D20 83.82,50.8; D21 86.36,50.8; GND 26.67,50.8; GND3 40.64,2.54; GND4 43.18,2.54; IOREF 30.48,2.54; NONE 27.94,2.54; RST 33.02,2.54; SCL1 19.05,50.8; SDA1 21.59,50.8; VIN 45.72,2.54 | drill 1.016 octagon: +5V 93.98,50.8; +5V1 96.52,50.8; D22 93.98,48.26; D23 96.52,48.26; D24 93.98,45.72; D25 96.52,45.72; D26 93.98,43.18; D27 96.52,43.18; D28 93.98,40.64; D29 96.52,40.64; D30 93.98,38.1; D31 96.52,38.1; D32 93.98,35.56; D33 96.52,35.56; D34 93.98,33.02; D35 96.52,33.02; D36 93.98,30.48; D37 96.52,30.48; D38 93.98,27.94; D39 96.52,27.94; D40 93.98,25.4; D41 96.52,25.4; D42 93.98,22.86; D43 96.52,22.86; D44 93.98,20.32; D45 96.52,20.32; D46 93.98,17.78; D47 96.52,17.78; D48 93.98,15.24; D49 96.52,15.24; D50 93.98,12.7; D51 96.52,12.7; D52 93.98,10.16; D53 96.52,10.16; GND1 96.52,7.62; GND2 93.98,7.62
E5-13 = drill 1.016 pad 2.54: + -2.54,0 | drill 1.016 pad 2.54 octagon: - 2.54,0
C025-024X044 = drill 0.813 octagon: 1 -1.27,0; 2 1.27,0
SMB = smd 2.4 x 2.4: A 2.2,0; C -2.2,0
F50VP = drill 1.016 octagon: 1 -22.073,-2.845; 2 -19.329,-2.845; 3 -16.561,-2.845; 4 -13.792,-2.845; 5 -11.049,-2.845; 6 -8.28,-2.845; 7 -5.512,-2.845; 8 -2.769,-2.845; 9 0,-2.845; 10 2.769,-2.845; 11 5.512,-2.845; 12 8.28,-2.845; 13 11.049,-2.845; 14 13.792,-2.845; 15 16.561,-2.845; 16 19.329,-2.845; 17 22.073,-2.845; 18 -20.701,0; 19 -17.932,0; 20 -15.189,0; 21 -12.421,0; 22 -9.652,0; 23 -6.909,0; 24 -4.14,0; 25 -1.372,0; 26 1.372,0; 27 4.14,0; 28 6.909,0; 29 9.652,0; 30 12.421,0; 31 15.189,0; 32 17.932,0; 33 20.701,0; 34 -22.073,2.845; 35 -19.329,2.845; 36 -16.561,2.845; 37 -13.792,2.845; 38 -11.049,2.845; 39 -8.28,2.845; 40 -5.512,2.845; 41 -2.769,2.845; 42 0,2.845; 43 2.769,2.845; 44 5.512,2.845; 45 8.28,2.845; 46 11.049,2.845; 47 13.792,2.845; 48 16.561,2.845; 49 19.329,2.845; 50 22.073,2.845 | drill 3.302 pad 5.08: G1 30.556,0; G2 -30.556,0
BELFUSE0679-3000-12 = smd 2.5 x 3.81: 1 -3.175,0; 2 3.175,0
W237-102 = drill 1.194 long: 1 -2.5,-1.27; 2 2.5,-1.27
3,0 = hole 3: 0,0
VNH5019 = drill 1.016 long: CS -16.51,5.08; ENA -16.51,10.16; ENB -16.51,2.54; GND -16.51,-5.08; GND1 -16.51,-10.16; GND-P2 19.05,0; GND-P3 19.05,2.54; INA -16.51,12.7; INB -16.51,0; OUTA 19.05,10.16; OUTA2 19.05,12.7; OUTB 19.05,5.08; OUTB1 19.05,7.62; PWM -16.51,7.62; VDD -16.51,-2.54; VIN0 19.05,-5.08; VIN1 19.05,-2.54; VOUT -16.51,-7.62 | drill 1.5: GND-P1 17.78,1.27; OUTA3 17.78,11.43; OUTB3 17.78,6.35; VIN2 17.78,-3.81
LED3MM = drill 0.813 octagon: A -1.27,0; K 1.27,0
0204/5 = drill 0.813 octagon: 1 -2.54,0; 2 2.54,0
RTRIMT93YA = drill 0.61: 1 0,-2.54; 2 0,0; 3 0,2.54
RASPI_GPIO_B+_BOX = drill 1 pad 1.778 square: 1 -24.13,-1.27 | drill 1 pad 1.778: 2 -24.13,1.27; 3 -21.59,-1.27; 4 -21.59,1.27; 5 -19.05,-1.27; 6 -19.05,1.27; 7 -16.51,-1.27; 8 -16.51,1.27; 9 -13.97,-1.27; 10 -13.97,1.27; 11 -11.43,-1.27; 12 -11.43,1.27; 13 -8.89,-1.27; 14 -8.89,1.27; 15 -6.35,-1.27; 16 -6.35,1.27; 17 -3.81,-1.27; 18 -3.81,1.27; 19 -1.27,-1.27; 20 -1.27,1.27; 21 1.27,-1.27; 22 1.27,1.27; 23 3.81,-1.27; 24 3.81,1.27; 25 6.35,-1.27; 26 6.35,1.27; 27 8.89,-1.27; 28 8.89,1.27; 29 11.43,-1.27; 30 11.43,1.27; 31 13.97,-1.27; 32 13.97,1.27; 33 16.51,-1.27; 34 16.51,1.27; 35 19.05,-1.27; 36 19.05,1.27; 37 21.59,-1.27; 38 21.59,1.27; 39 24.13,-1.27; 40 24.13,1.27
1X02 = drill 1.016 long: 1 -1.27,0; 2 1.27,0
0204/7 = drill 0.813 octagon: 1 -3.81,0; 2 3.81,0
SJ = smd 1.168 x 1.6: 1 -0.762,0; 2 0.762,0
DC/DC-STEP-DOWN-UNIVERSAL = drill 1.5 pad 2.5 square: IN+ -19.812,8.636; IN- -19.812,-8.636; OUT+ 19.812,8.636; OUT- 19.812,-8.636 | drill 0.8 pad 1.778 octagon: IN+1 -9.525,-6.35; IN+2 -9.525,-3.81; IN-1 -9.525,6.35; IN-2 -9.525,3.81; OUT+1 9.525,-6.35; OUT+2 9.525,-3.81; OUT-1 9.525,6.35; OUT-2 9.525,3.81
FE08 = drill 0.813 long: 1 -8.89,0; 2 -6.35,0; 3 -3.81,0; 4 -1.27,0; 5 1.27,0; 6 3.81,0; 7 6.35,0; 8 8.89,0
TSSOP20 = smd 0.305 x 0.991: 1 -2.925,-2.918; 2 -2.275,-2.918; 3 -1.625,-2.918; 4 -0.975,-2.918; 5 -0.325,-2.918; 6 0.325,-2.918; 7 0.975,-2.918; 8 1.625,-2.918; 9 2.275,-2.918; 10 2.925,-2.918; 11 2.925,2.918; 12 2.275,2.918; 13 1.625,2.918; 14 0.975,2.918; 15 0.325,2.918; 16 -0.325,2.918; 17 -0.975,2.918; 18 -1.625,2.918; 19 -2.275,2.918; 20 -2.925,2.918
P2-38-17 = drill 1.702 pad 2.121 long: TP-1 -1.905,0; TP-2 1.905,0

### Placement (x,y rotation side)
ARDUINO_MEGA_1  187.3,105.08 270 bottom
C1  3.15,46.66 270 top
C2  184.13,82.86 270 top
C3  131.42,83.49 180 top
D1  5.7,56.19 180 top
D-SUB50  93.96,77.14 180 top
F1  103.48,56.19 270 top
F2  103.48,21.89 270 top
F3  61.57,56.19 270 top
F4  61.57,21.89 270 top
F5  20.3,56.19 270 top
F6  20.3,21.89 270 top
FAN-PWR  2.52,33.96 90 top
H1  4.43,4.12 180 top
H2  4.43,85.4 180 top
H3  191.11,84.76 180 top
H4  191.75,4.75 0 top
M1  114.28,55.55 180 top
M2  114.28,21.26 180 top
M3  72.37,55.55 180 top
M4  72.37,21.26 180 top
M5  31.09,55.55 180 top
M6  31.09,21.26 180 top
MOT-P  2.52,64.44 90 top
P-ON  55.86,83.49 90 top
PWR  2.52,74.6 90 top
R1  98.41,65.71 90 top
R2  100.95,65.71 90 top
R3  103.48,65.71 90 top
R4  108.56,65.71 90 top
R5  106.03,65.71 90 top
R6  111.11,65.71 90 top
R-OFF  131.42,77.14 0 top
R-REF  191.75,72.06 180 top
RASPBERRY-PY  191.75,37.13 90 top
RESET-LOGIC  192.38,79.05 0 top
RL  46.33,80.95 270 top
SJ2  55.86,79.68 180 top
SP-DW  31.09,79.05 0 top
SV1  163.17,34.59 180 bottom
SV2  163.17,23.16 0 bottom
U1  163.17,28.88 180 bottom
U$2  [ALFY_15MM]  4.43,18.09 0 top
U$3  [ALFY_15MM]  116.19,47.93 0 bottom
VTEST-  55.86,72.06 270 top

### Tracks (layer width: path | path; a pad name or v marks a point on that pad's centre or on a via)
3.3V-ARD  (via drill 0.41)
  Top 0.203: v133.97,70.31 134.76,69.52 ARDUINO_MEGA_1.+3V3 186.67,69.52 R-REF.1
  Bottom 0.203: R-OFF.1 133.97,72.06 v133.97,70.31
+3V3  (via drill 0.3)
  Top 0.152: v161.11,30.79 174.48,30.79 175.11,30.15 v186.83,30.15
  Bottom 0.152: v161.11,30.79 161.11,31.58 160.95,31.74 U1.2 | v186.83,30.15 188.1,28.88 188.1,15.7 189.53,14.28 191.75,14.28 RASPBERRY-PY.1
+5V  (via drill 0.41)
  Top 0.203: ARDUINO_MEGA_1.+5V2 189.21,62.53 189.21,52.76 189.59,52.38 193.5,52.38 195.4,50.47 195.4,11.73 191.75,11.73 RASPBERRY-PY.2 | 134.6,24.91 131.9,24.91 M2.VDD | 134.6,24.91 v160.95,24.91 | 134.6,24.91 v134.6,19.58 | M4.VDD 88.44,23.36 57.12,23.36 56.32,22.55 50.8,22.55 50.78,22.53 48.88,22.53 M6.VDD
  Top 0.508: R6.1 R4.1 R5.1 R3.1 R2.1 R1.1 93.96,63.17 92.37,61.58 92.37,59.68 90.79,58.09 M3.VDD 86.98,58.09 86.34,58.73 86.34,60.63 79.44,67.53 75,67.53 73.02,65.55 53.8,65.55 50.78,62.53 50.78,59.36 49.51,58.09 M5.VDD | v111.74,58.09 M1.VDD | ARDUINO_MEGA_1.+5V2 133.97,66.98 133.33,66.35 v133.33,65.08 | RASPBERRY-PY.2 189.05,11.58 182.22,11.58 180.8,13 137.14,13 136.5,12.37 ARDUINO_MEGA_1.+5V | SJ2.2 48.88,79.68 RL.2
  Bottom 0.203: ARDUINO_MEGA_1.+5V1 ARDUINO_MEGA_1.+5V 134.6,13 v134.6,19.58 134.12,20.05 134.12,54.76 M1.VDD | v160.95,24.91 160.95,25.86 U1.19 | M4.VDD 91.26,26.18 91.26,35.07 90.47,35.87 90.47,38.41 91.26,39.2 91.26,55.71 M3.VDD
  Bottom 0.508: M5.VDD 46.33,58.09 45.06,59.36 45.06,75.87 RL.2 | v111.74,58.09 111.11,58.73 R6.1 | v133.33,65.08 133.33,58.73 132.69,58.09 M1.VDD
AR-ARX/PTX
  Top 0.152: ARDUINO_MEGA_1.D19 139.04,21.26 162.54,21.26 SV2.4
  Bottom 0.152: SV2.4 163.65,23.96 163.65,25.86 U1.15
AR-ATX/PRX  (via drill 0.3)
  Top 0.152: v164.29,27.1 166.98,24.4 166.98,24.28 | ARDUINO_MEGA_1.D18 137.46,25.39 160,25.39 160.16,25.55 164.44,25.55 165.72,24.28 166.98,24.28 | 166.98,24.28 SV2.3
  Bottom 0.152: v164.29,27.1 164.29,26.02 U1.14
AR-MISO  (via drill 0.3)
  Top 0.152: ARDUINO_MEGA_1.D50 173.49,9.99 170.79,9.99 170.64,10.15 170,10.15 169.68,9.83 v161.75,9.83
  Bottom 0.152: U1.18 161.43,26.02 161.43,26.5 161.11,26.82 156.82,26.82 SV2.7 156.82,20.47 160.48,16.81 160.48,11.1 v161.75,9.83
AR-MOSI  (via drill 0.3)
  Top 0.152: v160.63,22.37 159.84,21.58 155.87,21.58 SV2.8 | ARDUINO_MEGA_1.D51 173.49,7.45 v166.35,7.45
  Bottom 0.152: U1.20 160.32,25.86 160.32,22.69 v160.63,22.37 160.63,17.61 165.56,12.69 165.56,8.24 v166.35,7.45
AR-SCK  (via drill 0.3)
  Top 0.152: v162.06,27.1 160.98,26.02 v159.52,26.02 | ARDUINO_MEGA_1.D52 178.57,9.67 178.57,6.81 v164.76,6.81
  Bottom 0.152: v162.06,27.1 162.06,26.02 U1.17 | v159.52,26.02 159.36,25.86 SV2.6 159.36,18.4 163.02,14.75 163.02,8.56 v164.76,6.81
AR-SCL
  Top 0.152: ARDUINO_MEGA_1.D21 137.62,19.83 168.73,19.83 SV2.1
  Bottom 0.152: SV2.1 171.11,24.12 171.11,26.82 165.87,26.82 165.72,26.66 165.72,26.18 165.56,26.02 U1.12 | ARDUINO_MEGA_1.SCL1 134.6,84.12 134.6,20.62 ARDUINO_MEGA_1.D21
AR-SDA
  Top 0.152: ARDUINO_MEGA_1.D20 136.82,20.94 167.3,20.94 SV2.2
  Bottom 0.152: SV2.2 169.52,24.75 166.51,24.75 166.03,24.28 165.72,24.28 164.92,25.07 164.92,25.86 U1.13 | ARDUINO_MEGA_1.SDA1 138.41,81.59 138.41,23.16 ARDUINO_MEGA_1.D20
AR-SS  (via drill 0.3)
  Top 0.152: ARDUINO_MEGA_1.D53 176.03,9.67 170.64,9.67 v170.48,9.51
  Bottom 0.152: U1.16 162.7,25.86 162.7,23.96 SV2.5 170.64,14.43 170.64,9.67 v170.48,9.51
CHA1  (via drill 0.3)
  Top 0.152: v122.22,37.29 126.98,32.53 157.94,32.53 159.05,31.42 ARDUINO_MEGA_1.A8
  Bottom 0.152: v122.22,37.29 122.22,71.9 115.55,78.57 114.6,78.57 113.33,79.84 D-SUB50.2
CHA2
  Bottom 0.152: ARDUINO_MEGA_1.A9 186.67,30.79 186.67,54.6 182.86,58.41 182.86,87.46 123.65,87.46 116.19,80 D-SUB50.1
CHA3  (via drill 0.3)
  Top 0.152: v112.38,30.79 113.17,29.99 161.43,29.99 162.92,28.5 168.95,28.5 171.11,26.34 ARDUINO_MEGA_1.A10
  Bottom 0.152: D-SUB50.36 110.52,74.01 112.38,72.16 v112.38,30.79
CHA4  (via drill 0.3)
  Top 0.152: v147.46,70.16 144.28,70.16 140,74.44 135.39,74.44 134.12,73.17 114.44,73.17 113.33,74.28 D-SUB50.35 | v181.91,25.7 183.81,23.8 ARDUINO_MEGA_1.A11
  Bottom 0.152: v147.46,70.16 181.91,35.71 v181.91,25.7
CHA5  (via drill 0.3)
  Top 0.152: v146.03,70.79 144.12,70.79 140.16,74.76 135.23,74.76 134.28,73.81 118.09,73.81 114.76,77.14 D-SUB50.18 | v181.27,23.48 183.49,21.26 ARDUINO_MEGA_1.A12
  Bottom 0.152: v146.03,70.79 181.27,35.55 v181.27,23.48
CHA6  (via drill 0.3)
  Top 0.152: v114.28,29.36 128.57,15.07 181.11,15.07 ARDUINO_MEGA_1.A13
  Bottom 0.152: v114.28,29.36 116.03,31.1 116.03,74.28 D-SUB50.34
CHB1  (via drill 0.3)
  Top 0.152: v127.49,64.69 127.9,64.28 177.46,64.28 188.7,53.04 188.7,45.77 189.72,44.76 193.84,44.76 194.92,43.68 194.92,14.28 186.67,14.28 ARDUINO_MEGA_1.A14
  Bottom 0.152: v127.49,64.69 126.98,65.2 126.98,67.62 115.68,78.92 115.04,78.92 114.53,79.43 114.53,80.95 113.9,81.59 106.66,81.59 105.07,80 D-SUB50.5
CHB2  (via drill 0.3)
  Top 0.152: v109.52,30.79 112.38,27.93 113.96,27.93 127.14,14.75 183.65,14.75 ARDUINO_MEGA_1.A15
  Bottom 0.152: D-SUB50.21 107.14,77.14 109.12,75.16 109.12,73.41 109.77,72.76 109.77,31.04 v109.52,30.79
CHB3  (via drill 0.3)
  Top 0.152: v121.42,70.31 123.49,68.25 ARDUINO_MEGA_1.D10
  Bottom 0.152: v121.42,70.31 121.42,72.22 115.39,78.25 110.79,78.25 109.52,79.52 109.52,79.84 107.77,79.84 D-SUB50.4
CHB4
  Top 0.152: ARDUINO_MEGA_1.D11 136.35,70.95 109.2,70.95 109.2,77.14 D-SUB50.20
CHB5
  Top 0.152: ARDUINO_MEGA_1.D12 136.03,72.85 112.44,72.85 111.96,73.33 111.96,74.89 110.63,76.22 110.63,79.84 D-SUB50.3
CHB6
  Top 0.152: ARDUINO_MEGA_1.D13 131.42,75.87 129.84,74.28 123.33,74.28 119.36,78.25 113.01,78.25 D-SUB50.19
COM-ENABLE  (via drill 0.41 pad 0.9)
  Top 0.152: v168.16,29.77 170.48,27.45 189.05,27.45 189.53,26.97 191.75,26.97 RASPBERRY-PY.11
  Bottom 0.152: v168.16,29.77 166.19,31.74 U1.10
GND  (via drill 0.41)
  Top 0.203: P-ON.K 53.95,82.86 SP-DW.OUT-2 SP-DW.OUT-1 | 50.94,70.31 SP-DW.OUT- | M6.GND 45.7,28.25 45.7,31.42 M6.GND1 M4.GND1 M2.GND1 | v167.78,25.55 165.59,27.74 132.57,27.74 131.17,26.34 M2.GND
  Top 0.406: ARDUINO_MEGA_1.GND2 ARDUINO_MEGA_1.GND1 | ARDUINO_MEGA_1.GND3 ARDUINO_MEGA_1.GND4 | D-SUB50.28 D-SUB50.29 D-SUB50.30 D-SUB50.31 D-SUB50.32 D-SUB50.33 72.53,77.14 65.54,70.16 VTEST-.TP-2 55.7,70.31 50.94,70.31 | R-OFF.3 131.74,79.36 135.55,79.36 ARDUINO_MEGA_1.GND 180.95,78.41 C2.2 | M1.GND1 M3.GND1
  Bottom 0.203: 192.38,70.16 193.66,71.43 RESET-LOGIC.2 | M3.GND 86.98,62.53 86.98,63.8 M3.GND1 | M5.GND 49.51,62.53 49.51,63.8 M5.GND1 50.78,68.89 50.78,70.31 SP-DW.OUT- 50.94,70.47 50.94,79.84 P-ON.K | M4.GND 90.79,28.25 90.79,29.52 M4.GND1 | 130.16,60.63 128.88,61.9 128.88,64.06 130.54,65.71 | C3.2 130.16,80.95 | v167.78,25.55 166.52,25.55 U1.11 | 132.69,29.52 M2.GND1 | 132.69,29.52 132.69,28.25 M2.GND | M1.GND 130.03,60.63 128.5,59.11 128.5,55.49 129.61,54.38 132.69,54.38 132.69,29.52
  Bottom 0.406: ARDUINO_MEGA_1.GND2 193.84,11.1 194.42,11.67 194.42,16.81 191.75,16.81 RASPBERRY-PY.6 188.57,19.99 188.57,58.09 ARDUINO_MEGA_1.GND4 | 192.38,70.16 R-REF.3 191.75,70.16 191.11,70.79 | C2.2 186.67,79.05 186.67,75.24 191.11,70.79 | 191.11,70.79 ARDUINO_MEGA_1.GND3 | M3.GND1 87.13,67.46 87.13,77.14 D-SUB50.28 | 130.16,60.63 M1.GND | 130.54,65.71 M1.GND1 130.47,66.03 130.47,80.63 | 130.16,80.95 130.47,80.63 | 130.47,80.63 R-OFF.3
GNDA  (via drill 0.81, 0.81 pad 0.6)
  Top 1.778: M1.GND-P3 M1.GND-P1 96.02,54.91 95.87,54.91 M1.GND-P2 | M4.GND-P3 M4.GND-P1 54.11,20.62 53.95,20.62 M4.GND-P2 | M3.GND-P3 M3.GND-P1 54.11,54.91 53.95,54.91 M3.GND-P2 | SP-DW.IN-1 SP-DW.IN-2 | PWR.1 3.79,72.06 5.38,70.47 11.25,70.47 SP-DW.IN- | M6.GND-P3 M6.GND-P1 12.84,20.62 12.68,20.62 M6.GND-P2 | M5.GND-P2 12.68,54.91 12.84,54.91 M5.GND-P1 M5.GND-P3 9.51,53.01 8.24,51.74 8.24,49.84 3.15,44.76 C1.- | FAN-PWR.2 3.79,36.34 v46.97,36.34 47.76,36.5 v91.74,36.5
  Bottom 1.778: M2.GND-P3 M2.GND-P1 95.87,20.47 95.87,20.62 M2.GND-P2 94.44,21.58 92.53,21.58 92.53,36.5 | 92.53,36.5 92.53,51.26 94.28,53.01 M1.GND-P3 | M4.GND-P2 50.62,21.26 50.62,36.34 | 50.62,36.34 50.62,51.26 52.37,53.01 M3.GND-P3 | SP-DW.IN-2 11.41,72.7 11.41,70.47 SP-DW.IN- 11.73,69.68 15.7,65.71 15.7,53.01 15.14,52.45 | C1.- 3.15,37.13 3.79,36.5 FAN-PWR.2 | M6.GND-P1 15.7,22.37 15.7,51.9 15.14,52.45 | M5.GND-P1 15.14,52.45 | v46.97,36.34 50.62,36.34 | v91.74,36.5 92.53,36.5
IM1V
  Top 0.152: M1.CS 130.95,50.63 181.11,50.63 ARDUINO_MEGA_1.A0
IM2V  (via drill 0.3)
  Top 0.152: M2.CS 132.22,17.61 v176.19,17.61
  Bottom 0.152: v176.19,17.61 182.54,23.96 182.54,46.98 ARDUINO_MEGA_1.A2
IM3V
  Top 0.152: M3.CS 90.79,52.38 90.79,55.55 92.06,56.82 99.52,56.82 99.93,57.23 108.34,57.23 112.85,61.74 179.53,61.74 186.67,54.6 186.67,46.66 ARDUINO_MEGA_1.A3
IM4V  (via drill 0.3)
  Top 0.152: M4.CS 90.31,17.61 97.45,17.61 103.33,23.48 v109.2,23.48 | v128.25,42.53 130,44.28 134.44,44.28 135.39,45.23 183.65,45.23 ARDUINO_MEGA_1.A4
  Bottom 0.152: v128.25,42.53 v109.2,23.48
IM5V
  Top 0.152: M5.CS 45.06,47.93 45.06,42.12 45.7,41.48 58.27,41.48 59.32,42.53 85.96,42.53 87.2,41.29 134.57,41.29 135.39,40.47 139.68,40.47 140.79,41.58 ARDUINO_MEGA_1.A5
IM6V  (via drill 0.3)
  Top 0.152: M6.CS 45.7,14.28 45.7,9.67 49.83,9.67 54.59,4.91 v174.92,4.91
  Bottom 0.152: v174.92,4.91 178.57,8.56 178.57,19.51 182.86,23.8 182.86,37.13 ARDUINO_MEGA_1.A6
IN1A  (via drill 0.3)
  Top 0.203: v139.04,41.26 137.46,42.85 M1.INA
  Bottom 0.203: v139.04,41.26 ARDUINO_MEGA_1.D22
IN1B  (via drill 0.3)
  Top 0.203: v140.79,52.22 137.46,55.55 M1.INB
  Bottom 0.203: ARDUINO_MEGA_1.D23 140.16,9.67 140.16,37.93 139.84,38.25 139.84,39.04 140.79,39.99 v140.79,52.22
IN2A
  Top 0.203: M2.INA 132.22,9.99 140.47,9.99 ARDUINO_MEGA_1.D24
IN2B  (via drill 0.3)
  Top 0.203: M2.INB v133.49,18.56
  Bottom 0.203: ARDUINO_MEGA_1.D25 140.16,7.13 133.49,7.13 v133.49,18.56
IN3A  (via drill 0.3)
  Top 0.203: v90.63,39.36 91.58,38.41 v140.47,38.41
  Bottom 0.203: M3.INA 90.63,41.1 v90.63,39.36 | v140.47,38.41 141.27,37.61 141.27,16.5 144.12,13.64 ARDUINO_MEGA_1.D26
IN3B  (via drill 0.3, 0.41)
  Top 0.203: v86.34,30.79 87.13,29.99 109.84,29.99 127.3,12.53 133.81,12.53 135.39,14.12 v141.43,14.12
  Bottom 0.203: M3.INB 86.34,53.01 v86.34,30.79 | v141.43,14.12 142.06,14.12 143.01,13.16 143.01,9.67 ARDUINO_MEGA_1.D27
IN4A  (via drill 0.41)
  Top 0.203: M4.INA 91.9,5.54 v142.7,5.54
  Bottom 0.203: v142.7,5.54 145.55,8.4 145.55,9.99 ARDUINO_MEGA_1.D28
IN4B
  Top 0.203: M4.INB 93.33,25.7 93.33,27.45 93.96,28.09 106.34,28.09 127.46,6.97 145.08,6.97 ARDUINO_MEGA_1.D29
IN5A  (via drill 0.3, 0.41)
  Top 0.203: v49.03,39.83 51.1,37.77 121.9,37.77 122.06,37.93 140.16,37.93 145.08,33.01 157.94,33.01 158.89,32.05 v170.16,32.05
  Bottom 0.203: M5.INA 49.03,41.42 v49.03,39.83 | v170.16,32.05 173.33,28.88 173.33,9.83 ARDUINO_MEGA_1.D49
IN5B
  Bottom 0.203: M5.INB 45.22,53.17 45.22,8.72 50.78,3.16 170.95,3.16 170.95,9.2 172.06,10.31 ARDUINO_MEGA_1.D48
IN6A
  Bottom 0.203: M6.INA 52.53,3.64 169.52,3.64 ARDUINO_MEGA_1.D47
IN6B  (via drill 0.3)
  Top 0.203: M6.INB 51.57,17.29 59.19,17.29 59.51,16.97 v69.83,16.97
  Bottom 0.203: v69.83,16.97 75.55,16.97 88.4,4.12 164.44,4.12 164.44,4.43 168.41,8.4 168.41,9.99 ARDUINO_MEGA_1.D46
M1+  (via drill 0.41)
  Top 0.635: v67.86,40.18 v95.14,40.18
  Top 1.778: M1.OUTA2 M1.OUTA3 M1.OUTA
  Bottom 0.635: v67.86,40.18 67.86,75.97 71.73,79.84 D-SUB50.17 | v95.14,40.18 95.23,40.28 M1.OUTA2
M1-  (via drill 0.75)
  Top 0.635: D-SUB50.50 71.89,74.44 71.89,71.27 72.37,70.79 87.61,70.79 v88.88,69.52
  Bottom 0.635: M1.OUTB3 98.25,50.95 98.25,60.31 89.04,69.52 v88.88,69.52 | M1.OUTB3 M1.OUTB1 | M1.OUTB3 M1.OUTB
M1-FUSE
  Top 1.778: M1.VIN2 M1.VIN1 | M1.VIN2 M1.VIN0 | M1.VIN2 F1.1
M2+
  Top 1.778: M2.OUTA2 M2.OUTA3 M2.OUTA
  Bottom 0.635: M2.OUTA2 95.23,6.18 87.29,6.18 69.2,24.28 69.2,75.39 72.37,78.57 73.32,78.57 74.59,79.84 D-SUB50.16
M2-
  Top 0.635: M2.OUTB3 M2.OUTB
  Bottom 0.635: D-SUB50.49 74.75,74.28 75.07,73.97 75.07,19.67 87.61,7.13 93.17,7.13 93.17,11.73 95.07,13.64 M2.OUTB1 M2.OUTB3
M2-FUSE
  Top 1.778: M2.VIN2 M2.VIN1 | M2.VIN2 M2.VIN0 | M2.VIN2 F2.1
M3+  (via drill 0.41)
  Top 0.635: v73.32,45.55 72.05,44.28 54.75,44.28 M3.OUTA3
  Top 1.778: M3.OUTA2 M3.OUTA3 M3.OUTA
  Bottom 0.635: v73.32,45.55 73.2,45.68 73.2,75.05 74.59,76.44 74.59,77.9 75.51,78.82 76.28,78.82 77.29,79.84 D-SUB50.15
M3-  (via drill 0.41)
  Top 0.635: M3.OUTB1 M3.OUTB3 M3.OUTB 54.27,49.84 59.35,54.91 66.02,54.91 76.02,64.92 v76.02,65.55
  Bottom 0.635: v76.02,65.55 76.02,73.01 77.29,74.28 D-SUB50.48
M3-FUSE
  Top 1.778: M3.VIN2 M3.VIN1 | M3.VIN2 M3.VIN0 | M3.VIN2 F3.1
M4+
  Top 1.778: M4.OUTA2 M4.OUTA3 M4.OUTA
  Bottom 0.635: M4.OUTA3 56.34,11.58 56.34,47.45 66.5,57.61 66.5,79.68 68.62,81.81 78.34,81.81 80.15,80 D-SUB50.14
M4-  (via drill 0.41)
  Top 0.635: M4.OUTB3 M4.OUTB1 | M4.OUTB3 M4.OUTB | M4.OUTB3 54.75,15.07 71.1,15.07 76.97,20.94 v76.97,22.21
  Bottom 0.635: v76.97,22.21 76.97,71.11 80.15,74.28 D-SUB50.47
M4-FUSE
  Top 1.778: M4.VIN2 M4.VIN1 | M4.VIN2 M4.VIN0 | M4.VIN2 F4.1
M5+
  Top 0.635: D-SUB50.13 81.15,81.74 70.62,81.74 67.85,78.97 67.85,76.58 63.32,72.06 53.16,72.06 52.37,72.85 44.11,72.85 15.54,44.28 13.47,44.28 M5.OUTA3
  Top 1.778: M5.OUTA2 M5.OUTA3 M5.OUTA
M5-  (via drill 0.41)
  Top 0.635: M5.OUTB M5.OUTB3 M5.OUTB1 11.89,47.77 9.98,47.77 9.98,42.21 11.41,40.79 60.15,40.79 60.62,41.26 v77.93,41.26
  Bottom 0.635: v77.93,41.26 77.93,69.36 82.85,74.28 D-SUB50.46
M5-FUSE
  Top 1.778: M5.VIN2 M5.VIN1 | M5.VIN2 M5.VIN0 | M5.VIN2 F5.1
M6+
  Top 1.778: M6.OUTA2 M6.OUTA3 M6.OUTA
  Bottom 0.635: M6.OUTA3 42.05,38.56 42.05,74.6 54.11,86.67 78.88,86.67 85.55,80 D-SUB50.12
M6-  (via drill 0.41, 0.75)
  Top 0.635: M6.OUTB1 M6.OUTB3 M6.OUTB | v82.53,68.73 58.4,68.73 57.13,67.46 46.65,67.46 v20.93,41.74
  Bottom 0.635: v20.93,41.74 17.28,38.09 17.28,18.88 M6.OUTB3 | v82.53,68.73 85.68,71.88 D-SUB50.45
M6-FUSE
  Top 1.778: M6.VIN2 M6.VIN1 | M6.VIN2 M6.VIN0 | M6.VIN2 F6.1
MOT-EN
  Top 0.152: M1.ENA 130,44.6 100.63,44.6 97.64,41.61 92.66,41.61 M3.ENA | M6.ENA 48.88,12.37 87.61,12.37 M4.ENA
  Bottom 0.152: M1.ENB 128.88,51.1 128.88,47.3 M1.ENA 128.88,43.48 128.88,16.81 | 128.88,16.81 128.88,13 M2.ENA 132.69,9.2 132.69,4.91 149.52,4.91 152.86,8.24 152.86,9.67 157.94,9.67 ARDUINO_MEGA_1.D38 | M2.ENB 128.88,16.81 | M6.ENA 45.7,13 45.7,16.81 M6.ENB 45.7,20.62 45.7,47.3 | 45.7,47.3 M5.ENA | 45.7,47.3 45.7,51.1 M5.ENB | M4.ENA 86.98,13 86.98,16.81 M4.ENB 86.98,20.62 86.98,47.3 | 86.98,47.3 M3.ENA | 86.98,47.3 86.98,51.1 M3.ENB
MS1  (via drill 0.3)
  Top 0.152: ARDUINO_MEGA_1.D37 154.44,6.18 v110.95,6.18
  Bottom 0.152: v110.95,6.18 104.76,12.37 104.76,18.56 101.9,21.42 101.9,72.66 100.95,73.62 100.95,77.14 D-SUB50.23
MS2  (via drill 0.3)
  Top 0.152: v142.7,79.81 142.7,79.84 132.54,79.84 130.95,81.43 100.95,81.43 99.52,80 D-SUB50.7
  Bottom 0.152: ARDUINO_MEGA_1.D36 142.7,25.23 v142.7,79.81
MS3
  Bottom 0.152: ARDUINO_MEGA_1.D35 150.32,4.59 104.44,4.59 104.44,17.77 99.36,22.85 99.36,72.35 98.25,73.46 98.25,77.14 D-SUB50.24
MS4  (via drill 0.3)
  Top 0.152: v138.73,82.06 98.88,82.06 96.82,80 D-SUB50.8
  Bottom 0.152: ARDUINO_MEGA_1.D34 142.38,23.01 142.38,78.41 v138.73,82.06
MS5  (via drill 0.3)
  Top 0.152: v141.74,73.97 138.41,77.3 132.54,77.3 128.73,81.11 103.48,81.11 102.37,80 D-SUB50.6
  Bottom 0.152: ARDUINO_MEGA_1.D33 150.32,9.99 150.32,14.59 141.74,23.16 v141.74,73.97
MS6  (via drill 0.3)
  Top 0.152: ARDUINO_MEGA_1.D32 150.32,9.67 141.27,9.67 140.16,8.56 140.16,7.45 127.77,7.45 v108.41,26.82
  Bottom 0.152: v108.41,26.82 105.07,30.15 105.07,65.39 102.53,67.93 102.53,72.66 103.48,73.62 103.48,77.14 D-SUB50.22
N$1
  Top 0.152: P-ON.A 57.13,82.22 57.45,82.54 57.45,85.08 56.43,86.09 53.45,86.09 52.11,84.76 RL.1
N$2
  Top 1.778: MOT-P.1 3.79,56.48 D1.A
N$4
  Top 0.508: 59.03,80.32 59.03,86.67 57.76,87.94 51.16,87.94 SP-DW.OUT+ | 59.03,80.32 59.03,77.14 VTEST-.TP-1 54.59,75.24 SP-DW.OUT+2 SP-DW.OUT+1 | SJ2.1 58.4,79.68 59.03,80.32
N$5
  Top 0.152: ARDUINO_MEGA_1.RST 191.11,78.41 RESET-LOGIC.1
PWM1
  Top 0.203: M1.PWM 128.88,49.84 128.88,54.28 ARDUINO_MEGA_1.D5
PWM2  (via drill 0.3)
  Top 0.203: v133.49,44.91 135.23,46.66 ARDUINO_MEGA_1.D2
  Bottom 0.203: M2.PWM 132.85,15.7 132.85,27.77 133.49,28.4 v133.49,44.91
PWM3
  Top 0.203: M3.PWM 89.99,46.82 134.12,46.82 ARDUINO_MEGA_1.D3
PWM4  (via drill 0.3)
  Top 0.203: v98.72,47.45 100.47,49.2 122.22,49.2 129.84,56.82 ARDUINO_MEGA_1.D6
  Bottom 0.203: M4.PWM 92.85,17.61 93.96,17.61 94.12,17.45 98.72,17.45 v98.72,47.45
PWM5
  Top 0.203: M5.PWM 48.72,46.82 85.55,46.82 88.09,49.36 91.74,49.36 94.12,51.74 98.41,51.74 103.17,56.5 108.72,56.5 111.58,59.36 ARDUINO_MEGA_1.D7
PWM6  (via drill 0.3)
  Top 0.203: v59.83,41.74 60.11,42.02 85.74,42.02 86.82,40.95 134.44,40.95 135.39,39.99 v140,39.99 | v140.16,62.38 139.36,63.17 ARDUINO_MEGA_1.D8
  Bottom 0.203: M6.PWM 51.41,9.83 51.41,8.08 52.05,7.45 59.83,7.45 v59.83,41.74 | v140,39.99 140.16,40.15 v140.16,62.38
RP-ARX/PTX  (via drill 0.3)
  Top 0.152: v179.84,25.7 183.18,22.37 188.73,22.37 RASPBERRY-PY.8
  Bottom 0.152: U1.6 163.65,31.9 163.65,33.8 SV1.5 166.35,36.5 179.84,36.5 v179.84,25.7
RP-ATX/PRX
  Top 0.152: RASPBERRY-PY.10 191.75,24.43 193.91,24.43 194.29,24.82 194.29,29.52 188.89,29.52 185.4,33.01 168.57,33.01 SV1.6
  Bottom 0.152: SV1.6 166.51,34.59 164.29,32.37 164.29,31.9 U1.7
RP-MISO  (via drill 0.3)
  Top 0.152: v160.95,32.85 160.79,33.01 158.41,33.01 156.98,34.44 | RASPBERRY-PY.21 192.07,39.36 191.11,39.36 190.8,39.67 188.86,39.67 186.8,37.61 160.16,37.61 156.98,34.44 | 156.98,34.44 SV1.2
  Bottom 0.152: v160.95,32.85 161.43,32.37 161.43,31.9 U1.3
RP-MOSI  (via drill 0.3)
  Top 0.152: RASPBERRY-PY.19 191.75,37.13 188.51,37.13 186.76,35.39 173.81,35.39 172.7,36.5 v160.32,36.5
  Bottom 0.152: SV1.1 154.28,38.56 159.84,38.56 160.32,38.09 v160.32,36.5 160.32,31.9 U1.1
RP-SCK  (via drill 0.3)
  Top 0.152: RASPBERRY-PY.23 191.75,42.21 189.15,42.21 188.09,41.15 188.09,39.51 186.51,37.93 v159.68,37.93
  Bottom 0.152: U1.4 162.06,31.74 162.06,30.94 161.27,30.15 160,30.15 159.36,30.79 SV1.3 159.36,37.61 v159.68,37.93
RP-SCL
  Top 0.152: RASPBERRY-PY.5 194.61,19.67 194.61,32.05 186.83,32.05 184.29,34.59 SV1.8
  Bottom 0.152: SV1.8 172.06,36.18 169.05,36.18 168.57,35.71 168.57,33.01 166.19,33.01 165.72,32.53 165.72,32.05 165.56,31.9 U1.9
RP-SDA  (via drill 0.3)
  Top 0.152: RASPBERRY-PY.3 191.75,16.81 188.89,16.81 185.56,20.15 178.26,20.15 v172.7,25.7
  Bottom 0.152: 169.52,28.88 167.3,28.88 164.92,31.26 164.92,31.74 U1.8 | SV1.7 169.52,28.88 | 169.52,28.88 v172.7,25.7
RP-SS
  Top 0.152: SV1.4 163.49,36.18 172.54,36.18 173.81,34.91 189.21,34.91 189.53,34.59 193.97,34.59 194.29,34.91 194.29,39.67 191.75,39.67 RASPBERRY-PY.24
  Bottom 0.152: SV1.4 162.7,33.8 162.7,31.9 U1.5
V+
  Top 1.778: SP-DW.IN+1 SP-DW.IN+2 20.78,75.55 19.35,76.98 11.41,76.98 | 11.41,76.98 3.79,76.98 PWR.2 | 11.41,76.98 11.41,87.62 SP-DW.IN+
  Bottom 1.778: MOT-P.2 5.66,66.94 6.81,68.09 6.81,73.97 3.79,76.98 PWR.2
V-OFF
  Bottom 0.152: R-OFF.2 132.69,78.41 C3.1 132.69,87.14 149.36,87.14 ARDUINO_MEGA_1.A1
V-REF
  Top 0.152: ARDUINO_MEGA_1.AREF 136.98,81.43 181.43,81.43 C2.1
  Bottom 0.152: R-REF.2 187.15,76.66 187.15,81.11 C2.1
VDD  (via drill 0.81)
  Top 1.778: v103.48,21.89 F2.2 | F1.2 v103.48,50.47 | v61.57,21.89 F4.2 | F3.2 v61.57,50.47 | F6.2 24.11,22.53 24.11,31.42 | 24.11,31.42 3.79,31.42 FAN-PWR.1 | F5.2 24.11,56.82 24.11,64.44 10.14,64.44 7.9,62.2 D1.C 3.15,51.45 C1.+ | 24.11,31.42 24.9,31.74 26.49,33.33 v61.26,33.33 62.05,33.64 v103.17,33.64
  Bottom 1.778: v103.48,50.47 103.48,33.64 | 103.48,33.64 v103.48,21.89 | v61.57,50.47 61.57,33.33 | 61.57,33.33 v61.57,21.89 | C1.+ 6.81,45.55 6.81,34.59 3.79,31.58 FAN-PWR.1 | v61.26,33.33 61.57,33.33 | v103.17,33.64 103.48,33.64
VLED1
  Bottom 0.203: R1.2 95.33,71.33 95.33,74.98 94.02,76.28 94.02,78.03 93.64,78.41 90.02,78.41 D-SUB50.11
VLED2
  Top 0.203: R2.2 97.77,71.43 92.53,71.43 89.83,74.12 89.83,77.14 D-SUB50.27
VLED3
  Bottom 0.203: R3.2 103.96,68.73 103.96,75.39 105.01,76.44 105.01,77.84 103.48,79.36 103.48,80.95 102.85,81.59 92.06,81.59 91.19,80.72 D-SUB50.10
VLED4
  Top 0.203: R4.2 103.71,73.11 103.71,74.85 103.01,75.55 94.28,75.55 92.69,77.14 D-SUB50.26
VLED5
  Top 0.203: R5.2 101.74,72.54 93.61,72.54 92.56,73.58 92.56,74.92 91.17,76.32 91.17,78 92.06,78.89 93.01,78.89 93.96,79.84 D-SUB50.9
VLED6
  Top 0.203: R6.2 106.28,73.08 106.28,75.14 105.39,76.03 96.5,76.03 95.39,77.14 D-SUB50.25

### Text on the board
tPlace: Developed by: / Ing. Emanuele Alfano
bPlace: Developed by: / Ing. Emanuele Alfano | RP-MOSI | RP-MISO | RP-SCK | RP-SS | RP-ARX/PTX | RP-ATX/PRX | RP-SDA | RP-SCL | Com-enable | AR-MOSI | AR-MISO | AR-SCK | AR-SS | AR-ARX/PTX | AR-ATX/PRX | AR-SDA | AR-SCL
tNames: +12V | Vcc | GND | Gnd | GND | +12V
200bmp: Università degli studi / Tor Vergata
201bmp: Università degli studi / Tor Vergata